# EAGLE schematic CPU (EAGLE 7.5.0), part 7 of 7
## Module ARDUINO
Ports: DATABUS_1(out) DATABUS_2(out) DATABUS_3(out) DATABUS_4(out) DATABUS_5(out) DATABUS_6(out) DATABUS_7(out) DATABUS_8(out) WRITE(out) SWITCH_BUSES(out) ADDRESSBUS_1(out) ADDRESSBUS_2(out) ADDRESSBUS_3(out) ADDRESSBUS_4(out) ADDRESSBUS_5(out) ADDRESSBUS_6(out) ADDRESSBUS_7(out) ADDRESSBUS_8(out) ADDRESSBUS_9(out) ADDRESSBUS_10(out) ADDRESSBUS_11(out) ADDRESSBUS_12(out) ADDRESSBUS_13(out) ADDRESSBUS_14(out) ADDRESSBUS_15(out) ADDRESSBUS_16(out) VCC(in) GND(in)
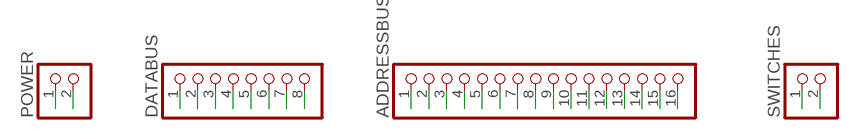
[diagram p96: schematic, module ARDUINO, sheet 1]

### Parts
ADDRESSBUS  PINHD-1X16  [1X16]
DATABUS  PINHD-1X8  [1X08]
POWER  PINHD-1X2  [1X02]
SWITCHES  PINHD-1X2  [1X02]

### Nets
ADDRESSBUS_1: ADDRESSBUS.1
ADDRESSBUS_2: ADDRESSBUS.2
ADDRESSBUS_3: ADDRESSBUS.3
ADDRESSBUS_4: ADDRESSBUS.4
ADDRESSBUS_5: ADDRESSBUS.5
ADDRESSBUS_6: ADDRESSBUS.6
ADDRESSBUS_7: ADDRESSBUS.7
ADDRESSBUS_8: ADDRESSBUS.8
ADDRESSBUS_9: ADDRESSBUS.9
ADDRESSBUS_10: ADDRESSBUS.10
ADDRESSBUS_11: ADDRESSBUS.11
ADDRESSBUS_12: ADDRESSBUS.12
ADDRESSBUS_13: ADDRESSBUS.13
ADDRESSBUS_14: ADDRESSBUS.14
ADDRESSBUS_15: ADDRESSBUS.15
ADDRESSBUS_16: ADDRESSBUS.16
DATABUS_1: DATABUS.1
DATABUS_2: DATABUS.2
DATABUS_3: DATABUS.3
DATABUS_4: DATABUS.4
DATABUS_5: DATABUS.5
DATABUS_6: DATABUS.6
DATABUS_7: DATABUS.7
DATABUS_8: DATABUS.8
GND: POWER.2
SWITCH_BUSES: SWITCHES.2
VCC: POWER.1
WRITE: SWITCHES.1

### Library data of the parts
ADDRESSBUS = pinhead:PINHD-1X16: PIN HEADER
DATABUS = pinhead:PINHD-1X8: PIN HEADER
POWER SWITCHES = pinhead:PINHD-1X2: PIN HEADER

## Module ARDUINO_INTERFACE
Ports: DATABUS_1(out) DATABUS_2(out) DATABUS_3(out) DATABUS_4(out) DATABUS_5(out) DATABUS_6(out) DATABUS_7(out) DATABUS_8(out) ADDRESSBUS_1(out) ADDRESSBUS_2(out) ADDRESSBUS_3(out) ADDRESSBUS_4(out) ADDRESSBUS_5(out) ADDRESSBUS_6(out) ADDRESSBUS_7(out) ADDRESSBUS_8(out) ADDRESSBUS_9(out) ADDRESSBUS_10(out) ADDRESSBUS_11(out) ADDRESSBUS_12(out) ADDRESSBUS_13(out) ADDRESSBUS_14(out) ADDRESSBUS_15(out) ADDRESSBUS_16(out) VCC(in) GND(in) LOAD_SRAM_INPUT(in) LOAD_SRAM_OUTPUT(out) SELECT_SRAM_INPUT(in) SELECT_SRAM_OUTPUT(out)
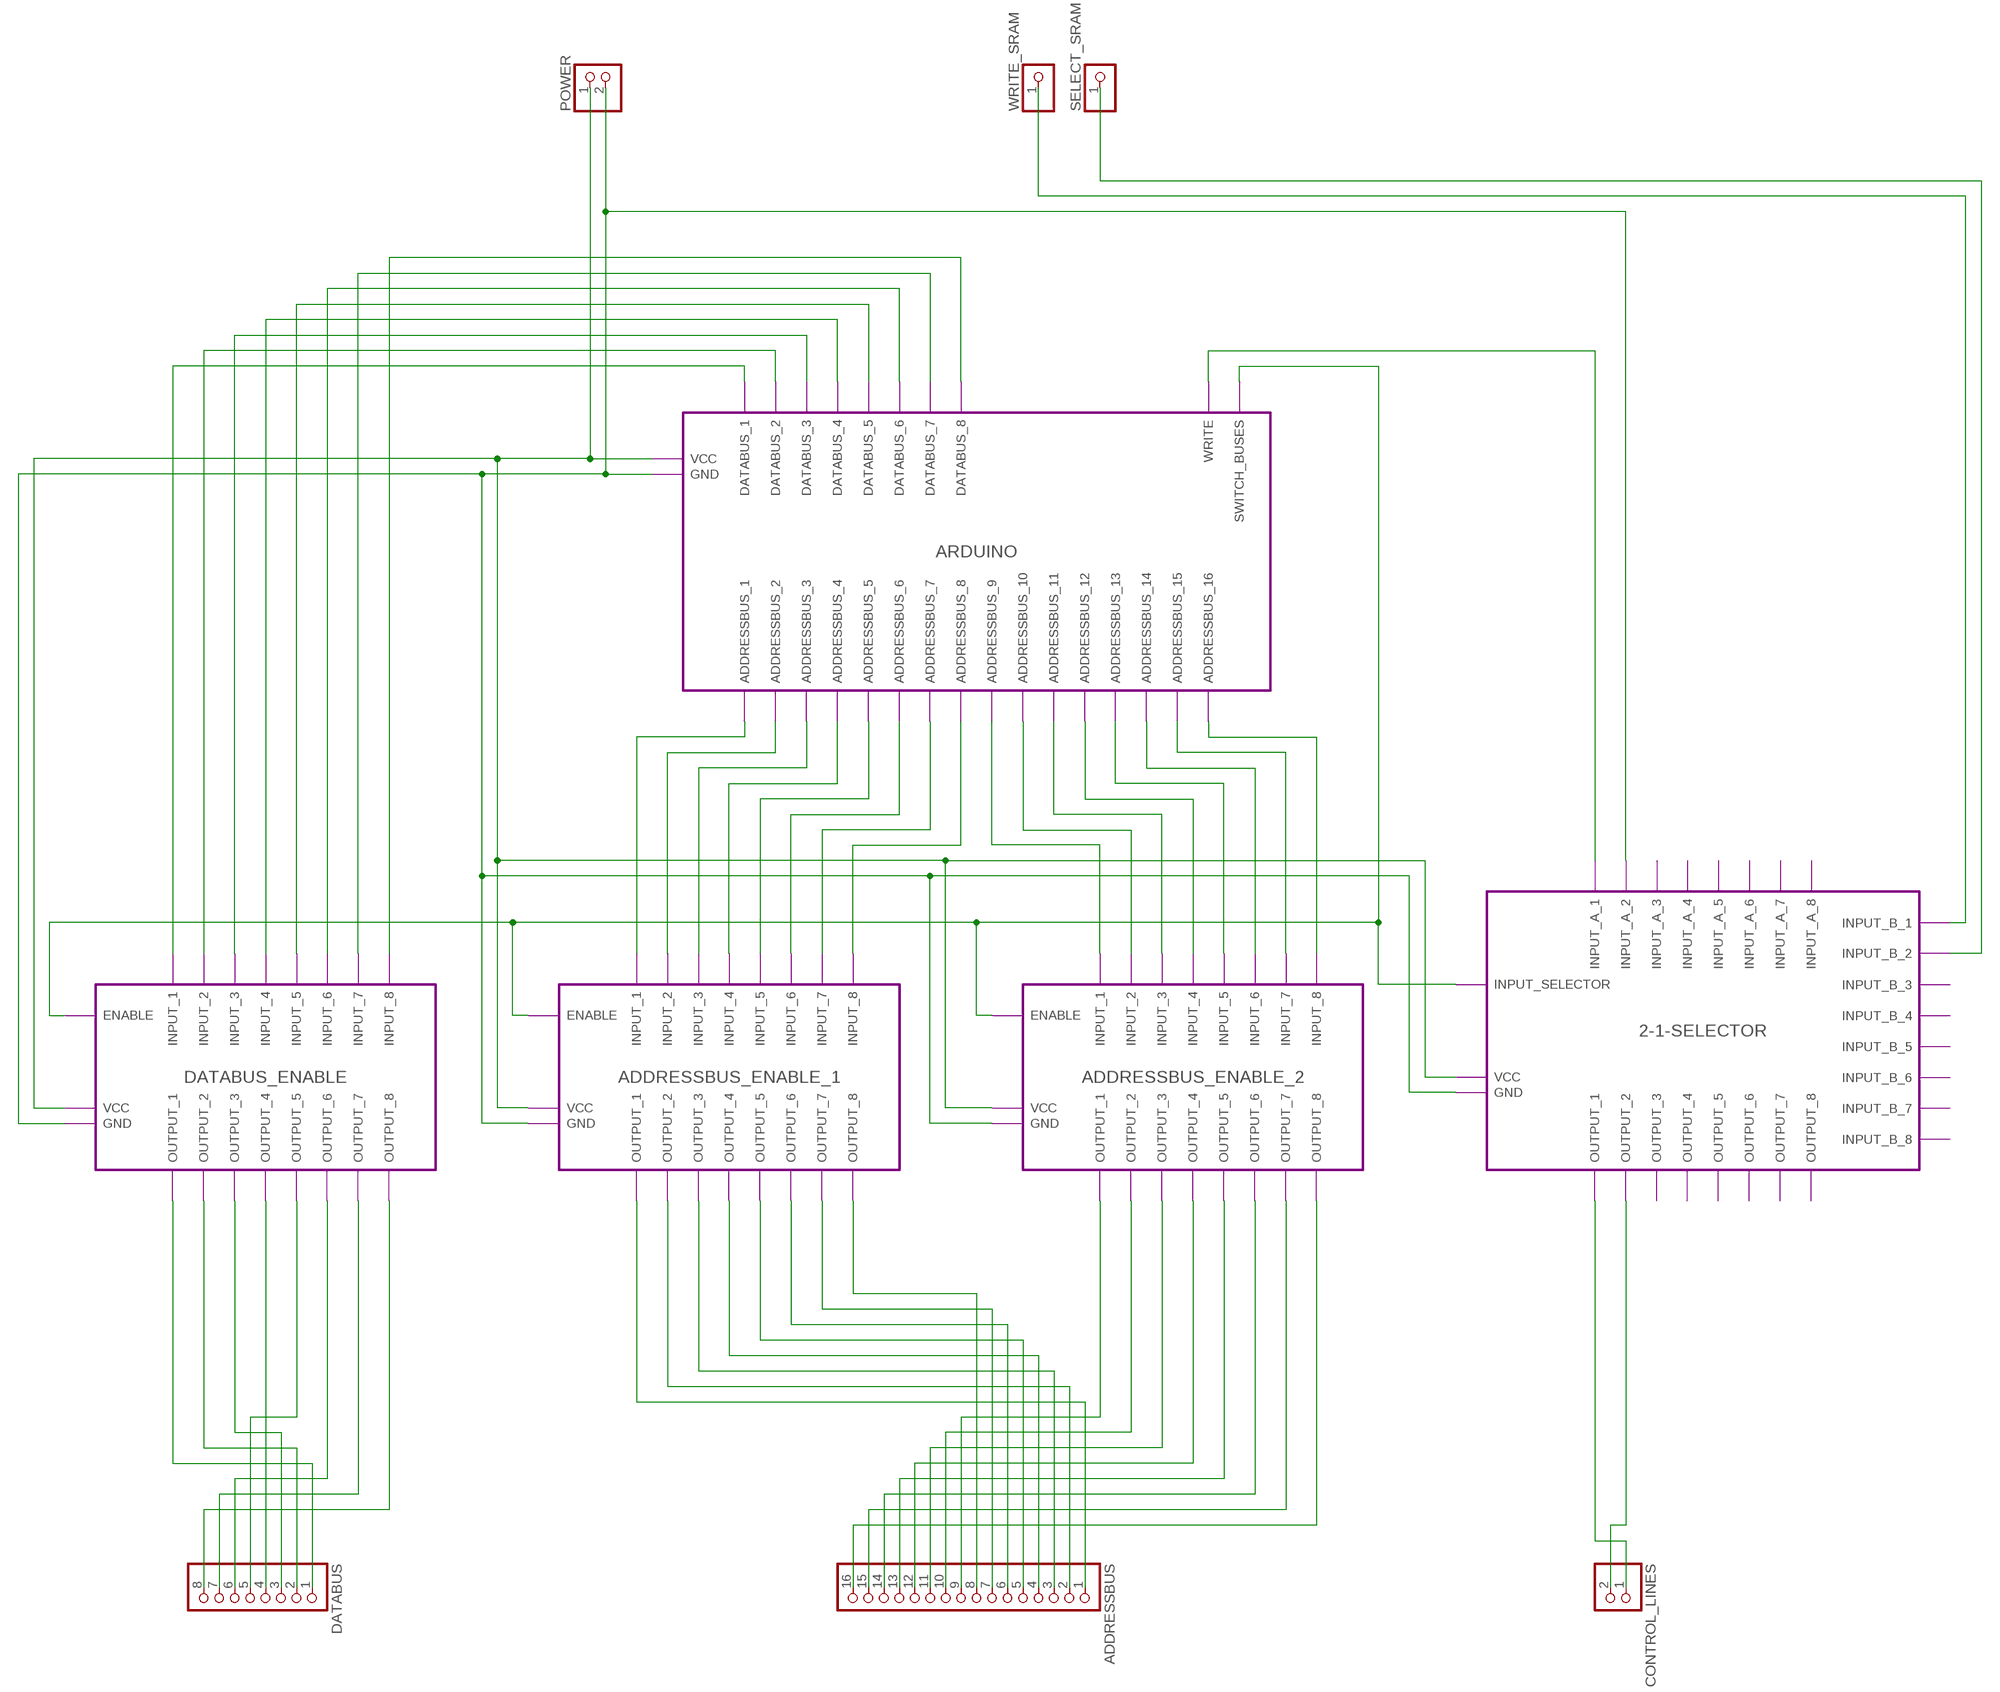
[diagram p97: schematic, module ARDUINO_INTERFACE, sheet 1]

### Parts
ADDRESSBUS  PINHD-1X16  [1X16]
CONTROL_LINES  PINHD-1X2  [1X02]
DATABUS  PINHD-1X8  [1X08]
POWER  PINHD-1X2  [1X02]
SELECT_SRAM  PINHD-1X1  [1X01]
WRITE_SRAM  PINHD-1X1  [1X01]

### Module instances
DATABUS_ENABLE = BUS_ENABLE
ADDRESSBUS_ENABLE_1 = BUS_ENABLE
ARDUINO = ARDUINO
2-1-SELECTOR = 2-1-SELECTOR
ADDRESSBUS_ENABLE_2 = BUS_ENABLE

### Nets
ADDRESSBUS_1: ADDRESSBUS.1 ; port ADDRESSBUS_ENABLE_1.OUTPUT_1
ADDRESSBUS_2: ADDRESSBUS.2 ; port ADDRESSBUS_ENABLE_1.OUTPUT_2
ADDRESSBUS_3: ADDRESSBUS.3 ; port ADDRESSBUS_ENABLE_1.OUTPUT_3
ADDRESSBUS_4: ADDRESSBUS.4 ; port ADDRESSBUS_ENABLE_1.OUTPUT_4
ADDRESSBUS_5: ADDRESSBUS.5 ; port ADDRESSBUS_ENABLE_1.OUTPUT_5
ADDRESSBUS_6: ADDRESSBUS.6 ; port ADDRESSBUS_ENABLE_1.OUTPUT_6
ADDRESSBUS_7: ADDRESSBUS.7 ; port ADDRESSBUS_ENABLE_1.OUTPUT_7
ADDRESSBUS_8: ADDRESSBUS.8 ; port ADDRESSBUS_ENABLE_1.OUTPUT_8
ADDRESSBUS_9: ADDRESSBUS.9 ; port ADDRESSBUS_ENABLE_2.OUTPUT_1
ADDRESSBUS_10: ADDRESSBUS.10 ; port ADDRESSBUS_ENABLE_2.OUTPUT_2
ADDRESSBUS_11: ADDRESSBUS.11 ; port ADDRESSBUS_ENABLE_2.OUTPUT_3
ADDRESSBUS_12: ADDRESSBUS.12 ; port ADDRESSBUS_ENABLE_2.OUTPUT_4
ADDRESSBUS_13: ADDRESSBUS.13 ; port ADDRESSBUS_ENABLE_2.OUTPUT_5
ADDRESSBUS_14: ADDRESSBUS.14 ; port ADDRESSBUS_ENABLE_2.OUTPUT_6
ADDRESSBUS_15: ADDRESSBUS.15 ; port ADDRESSBUS_ENABLE_2.OUTPUT_7
ADDRESSBUS_16: ADDRESSBUS.16 ; port ADDRESSBUS_ENABLE_2.OUTPUT_8
DATABUS_1: DATABUS.1 ; port DATABUS_ENABLE.OUTPUT_1
DATABUS_2: DATABUS.2 ; port DATABUS_ENABLE.OUTPUT_2
DATABUS_3: DATABUS.3 ; port DATABUS_ENABLE.OUTPUT_3
DATABUS_4: DATABUS.4 ; port DATABUS_ENABLE.OUTPUT_4
DATABUS_5: DATABUS.5 ; port DATABUS_ENABLE.OUTPUT_5
DATABUS_6: DATABUS.6 ; port DATABUS_ENABLE.OUTPUT_6
DATABUS_7: DATABUS.7 ; port DATABUS_ENABLE.OUTPUT_7
DATABUS_8: DATABUS.8 ; port DATABUS_ENABLE.OUTPUT_8
GND: POWER.2 ; port ARDUINO.GND 2-1-SELECTOR.INPUT_A_2 DATABUS_ENABLE.GND ADDRESSBUS_ENABLE_1.GND ADDRESSBUS_ENABLE_2.GND 2-1-SELECTOR.GND
LOAD_SRAM_INPUT: WRITE_SRAM.1
LOAD_SRAM_OUTPUT: CONTROL_LINES.1 ; port 2-1-SELECTOR.OUTPUT_1
N$1: port ARDUINO.ADDRESSBUS_1 ADDRESSBUS_ENABLE_1.INPUT_1
N$2: port ADDRESSBUS_ENABLE_1.INPUT_2 ARDUINO.ADDRESSBUS_2
N$3: port ARDUINO.ADDRESSBUS_3 ADDRESSBUS_ENABLE_1.INPUT_3
N$4: port ADDRESSBUS_ENABLE_1.INPUT_4 ARDUINO.ADDRESSBUS_4
N$5: port ARDUINO.ADDRESSBUS_5 ADDRESSBUS_ENABLE_1.INPUT_5
N$6: port ADDRESSBUS_ENABLE_1.INPUT_6 ARDUINO.ADDRESSBUS_6
N$7: port ARDUINO.ADDRESSBUS_7 ADDRESSBUS_ENABLE_1.INPUT_7
N$8: port ADDRESSBUS_ENABLE_1.INPUT_8 ARDUINO.ADDRESSBUS_8
N$9: port ARDUINO.ADDRESSBUS_16 ADDRESSBUS_ENABLE_2.INPUT_8
N$10: port ADDRESSBUS_ENABLE_2.INPUT_7 ARDUINO.ADDRESSBUS_15
N$11: port ARDUINO.ADDRESSBUS_14 ADDRESSBUS_ENABLE_2.INPUT_6
N$12: port ADDRESSBUS_ENABLE_2.INPUT_5 ARDUINO.ADDRESSBUS_13
N$13: port ARDUINO.ADDRESSBUS_12 ADDRESSBUS_ENABLE_2.INPUT_4
N$14: port ADDRESSBUS_ENABLE_2.INPUT_3 ARDUINO.ADDRESSBUS_11
N$15: port ARDUINO.ADDRESSBUS_10 ADDRESSBUS_ENABLE_2.INPUT_2
N$16: port ADDRESSBUS_ENABLE_2.INPUT_1 ARDUINO.ADDRESSBUS_9
N$17: port ARDUINO.DATABUS_1 DATABUS_ENABLE.INPUT_1
N$18: port ARDUINO.DATABUS_2 DATABUS_ENABLE.INPUT_2
N$19: port DATABUS_ENABLE.INPUT_3 ARDUINO.DATABUS_3
N$20: port ARDUINO.DATABUS_4 DATABUS_ENABLE.INPUT_4
N$21: port DATABUS_ENABLE.INPUT_5 ARDUINO.DATABUS_5
N$22: port ARDUINO.DATABUS_6 DATABUS_ENABLE.INPUT_6
N$23: port DATABUS_ENABLE.INPUT_7 ARDUINO.DATABUS_7
N$24: port ARDUINO.DATABUS_8 DATABUS_ENABLE.INPUT_8
N$25: port ARDUINO.SWITCH_BUSES DATABUS_ENABLE.ENABLE ADDRESSBUS_ENABLE_1.ENABLE ADDRESSBUS_ENABLE_2.ENABLE 2-1-SELECTOR.INPUT_SELECTOR
N$26: port ARDUINO.WRITE 2-1-SELECTOR.INPUT_A_1
SELECT_SRAM_INPUT: SELECT_SRAM.1 ; port 2-1-SELECTOR.INPUT_B_2
SELECT_SRAM_OUTPUT: CONTROL_LINES.2 ; port 2-1-SELECTOR.OUTPUT_2
VCC: POWER.1 ; port ARDUINO.VCC DATABUS_ENABLE.VCC ADDRESSBUS_ENABLE_1.VCC ADDRESSBUS_ENABLE_2.VCC 2-1-SELECTOR.VCC

### Library data of the parts
ADDRESSBUS = pinhead:PINHD-1X16: PIN HEADER
CONTROL_LINES POWER = pinhead:PINHD-1X2: PIN HEADER
DATABUS = pinhead:PINHD-1X8: PIN HEADER
SELECT_SRAM WRITE_SRAM = pinhead:PINHD-1X1: PIN HEADER

## Module FULL_ADDER_16BIT
Ports: INPUT_A_1(in) INPUT_A_2(in) INPUT_A_3(in) INPUT_A_4(in) INPUT_A_5(in) INPUT_A_6(in) INPUT_A_7(in) INPUT_A_8(in) INPUT_A_9(in) INPUT_A_10(in) INPUT_A_11(in) INPUT_A_12(in) INPUT_A_13(in) INPUT_A_14(in) INPUT_A_15(in) INPUT_A_16(in) INPUT_B_2(in) INPUT_B_1(in) INPUT_B_3(in) INPUT_B_4(in) INPUT_B_5(in) INPUT_B_6(in) INPUT_B_7(in) INPUT_B_8(in) INPUT_B_9(in) INPUT_B_10(in) INPUT_B_11(in) INPUT_B_12(in) INPUT_B_13(in) INPUT_B_14(in) INPUT_B_15(in) INPUT_B_16(in) RESULT_1(out) RESULT_2(out) RESULT_3(out) RESULT_4(out) RESULT_5(out) RESULT_6(out) RESULT_7(out) RESULT_8(out) RESULT_9(out) RESULT_10(out) RESULT_11(out) RESULT_12(out) RESULT_13(out) RESULT_14(out) RESULT_15(out) RESULT_16(out) VCC(in) GND(in) LOAD_ADDER16BIT_INPUT_A(in) LOAD_ADDER16BIT_INPUT_B(in) SELECT_ADDER16BIT_INPUT_A(in) SELECT_ADDER16BIT_INPUT_B(in) LOAD_ADDER16BIT_OUTPUT_C(in) SELECT_ADDER16BIT_OUTPUT_C(in)
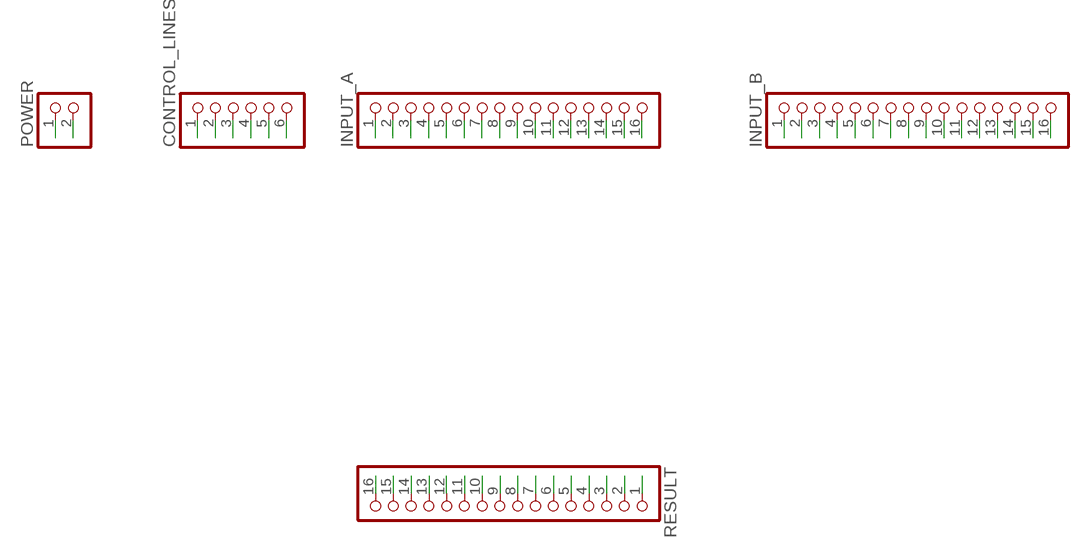
[diagram p98: schematic, module FULL_ADDER_16BIT, sheet 1]

### Parts
CONTROL_LINES  PINHD-1X6  [1X06]
INPUT_A  PINHD-1X16  [1X16]
INPUT_B  PINHD-1X16  [1X16]
POWER  PINHD-1X2  [1X02]
RESULT  PINHD-1X16  [1X16]

### Nets
GND: POWER.2
INPUT_A_1: INPUT_A.1
INPUT_A_2: INPUT_A.2
INPUT_A_3: INPUT_A.3
INPUT_A_4: INPUT_A.4
INPUT_A_5: INPUT_A.5
INPUT_A_6: INPUT_A.6
INPUT_A_7: INPUT_A.7
INPUT_A_8: INPUT_A.8
INPUT_A_9: INPUT_A.9
INPUT_A_10: INPUT_A.10
INPUT_A_11: INPUT_A.11
INPUT_A_12: INPUT_A.12
INPUT_A_13: INPUT_A.13
INPUT_A_14: INPUT_A.14
INPUT_A_15: INPUT_A.15
INPUT_A_16: INPUT_A.16
INPUT_B_1: INPUT_B.1
INPUT_B_2: INPUT_B.2
INPUT_B_3: INPUT_B.3
INPUT_B_4: INPUT_B.4
INPUT_B_5: INPUT_B.5
INPUT_B_6: INPUT_B.6
INPUT_B_7: INPUT_B.7
INPUT_B_8: INPUT_B.8
INPUT_B_9: INPUT_B.9
INPUT_B_10: INPUT_B.10
INPUT_B_11: INPUT_B.11
INPUT_B_12: INPUT_B.12
INPUT_B_13: INPUT_B.13
INPUT_B_14: INPUT_B.14
INPUT_B_15: INPUT_B.15
INPUT_B_16: INPUT_B.16
LOAD_ADDER16BIT_INPUT_A: CONTROL_LINES.1
LOAD_ADDER16BIT_INPUT_B: CONTROL_LINES.2
LOAD_ADDER16BIT_OUTPUT_C: CONTROL_LINES.5
RESULT_1: RESULT.1
RESULT_2: RESULT.2
RESULT_3: RESULT.3
RESULT_4: RESULT.4
RESULT_5: RESULT.5
RESULT_6: RESULT.6
RESULT_7: RESULT.7
RESULT_8: RESULT.8
RESULT_9: RESULT.9
RESULT_10: RESULT.10
RESULT_11: RESULT.11
RESULT_12: RESULT.12
RESULT_13: RESULT.13
RESULT_14: RESULT.14
RESULT_15: RESULT.15
RESULT_16: RESULT.16
SELECT_ADDER16BIT_INPUT_A: CONTROL_LINES.3
SELECT_ADDER16BIT_INPUT_B: CONTROL_LINES.4
SELECT_ADDER16BIT_OUTPUT_C: CONTROL_LINES.6
VCC: POWER.1

### Library data of the parts
CONTROL_LINES = pinhead:PINHD-1X6: PIN HEADER
INPUT_A INPUT_B RESULT = pinhead:PINHD-1X16: PIN HEADER
POWER = pinhead:PINHD-1X2: PIN HEADER

## Module BASE
Ports: ADDRESSBUS_1(io) ADDRESSBUS_2(io) ADDRESSBUS_3(io) ADDRESSBUS_4(io) ADDRESSBUS_5(io) ADDRESSBUS_6(io) ADDRESSBUS_7(io) ADDRESSBUS_8(io) ADDRESSBUS_9(io) ADDRESSBUS_10(io) ADDRESSBUS_11(io) ADDRESSBUS_12(io) ADDRESSBUS_13(io) ADDRESSBUS_14(io) ADDRESSBUS_15(io) ADDRESSBUS_16(io) CURRENT_INSTRUCTION_1(out) CURRENT_INSTRUCTION_2(out) CURRENT_INSTRUCTION_3(out) CURRENT_INSTRUCTION_4(out) CURRENT_INSTRUCTION_5(out) CURRENT_INSTRUCTION_6(out) CURRENT_INSTRUCTION_7(out) CURRENT_INSTRUCTION_8(out) DATABUS_1(io) DATABUS_2(io) DATABUS_3(io) DATABUS_4(io) DATABUS_5(io) DATABUS_6(io) DATABUS_7(io) DATABUS_8(io) ALU_FUNCTIONCODE_1(out) ALU_FUNCTIONCODE_2(out) ALU_FUNCTIONCODE_3(out) ALU_FUNCTIONCODE_4(out) FLAGSBUS_1(io) FLAGSBUS_2(io) FLAGSBUS_3(io) FLAGSBUS_4(io) INPUT_PORT_A_1(in) INPUT_PORT_A_2(in) INPUT_PORT_A_3(in) INPUT_PORT_A_4(in) INPUT_PORT_A_5(in) INPUT_PORT_A_6(in) INPUT_PORT_A_7(in) INPUT_PORT_A_8(in) INPUT_PORT_B_1(in) INPUT_PORT_B_3(in) INPUT_PORT_B_2(in) INPUT_PORT_B_4(in) INPUT_PORT_B_5(in) INPUT_PORT_B_6(in) INPUT_PORT_B_7(in) INPUT_PORT_B_8(in) OUTPUT_PORT_C_1(out) OUTPUT_PORT_C_2(out) OUTPUT_PORT_C_3(out) OUTPUT_PORT_C_4(out) OUTPUT_PORT_C_5(out) OUTPUT_PORT_C_6(out) OUTPUT_PORT_C_7(out) OUTPUT_PORT_C_8(out) OUTPUT_PORT_D_1(out) OUTPUT_PORT_D_2(out) OUTPUT_PORT_D_3(out) OUTPUT_PORT_D_4(out) OUTPUT_PORT_D_5(out) OUTPUT_PORT_D_6(out) OUTPUT_PORT_D_7(out) OUTPUT_PORT_D_8(out) T1(out) T2(out) T3(out) T4(out) T5(out) T6(out) T7(out) T8(out) GND(in) VCC(in) CLOCK(out) CPU_START(in) AUTO_MANUAL(in) MANUAL_TICK(in) LOAD_PORT_A(in) SELECT_PORT_A(in) LOAD_PORT_B(in) SELECT_PORT_B(in) LOAD_PORT_C(in) SELECT_PORT_C(in) LOAD_PORT_D(in) SELECT_PORT_D(in) SRAM_LOAD(in) SRAM_SELECT(in) LOAD_A(in) SELECT_A(in) LOAD_B(in) SELECT_B(in) LOAD_C(in) SELECT_C(in) LOAD_INTERNAL_A(in) SELECT_INTERNAL_A(in) LOAD_INC(in) SELECT_INC(in) LOAD_PC(in) SELECT_PC(in) LOAD_INSTRUCTION_REGISTER(in) SELECT_INSTRUCTION_REGISTER_TO_ALU(in) SELECT_INSTRUCTION_REGISTER_TO_DATABUS(in) LOAD_FLAGS(in) SELECT_FLAGS(in) LOAD_FLAGS_SAVED(in) SELECT_FLAGS_SAVED(in) PC_INCREMENTER_ENABLE(in) LOAD_FLAGS_INBUFFER(in) SELECT_FLAGS_INBUFFER(in) LOAD_FLAGS_OUTBUFFER(in) SELECT_FLAGS_OUTBUFFER(in) LOAD_ADDER16BIT_INPUT_A(in) SELECT_ADDER16BIT_INPUT_A(in) LOAD_ADDER16BIT_INPUT_B(in) SELECT_ADDER16BIT_INPUT_B(in) LOAD_ADDER16BIT_OUTPUT_C(in) SELECT_ADDER16BIT_OUTPUT_C(in) CPU_STOP(in)
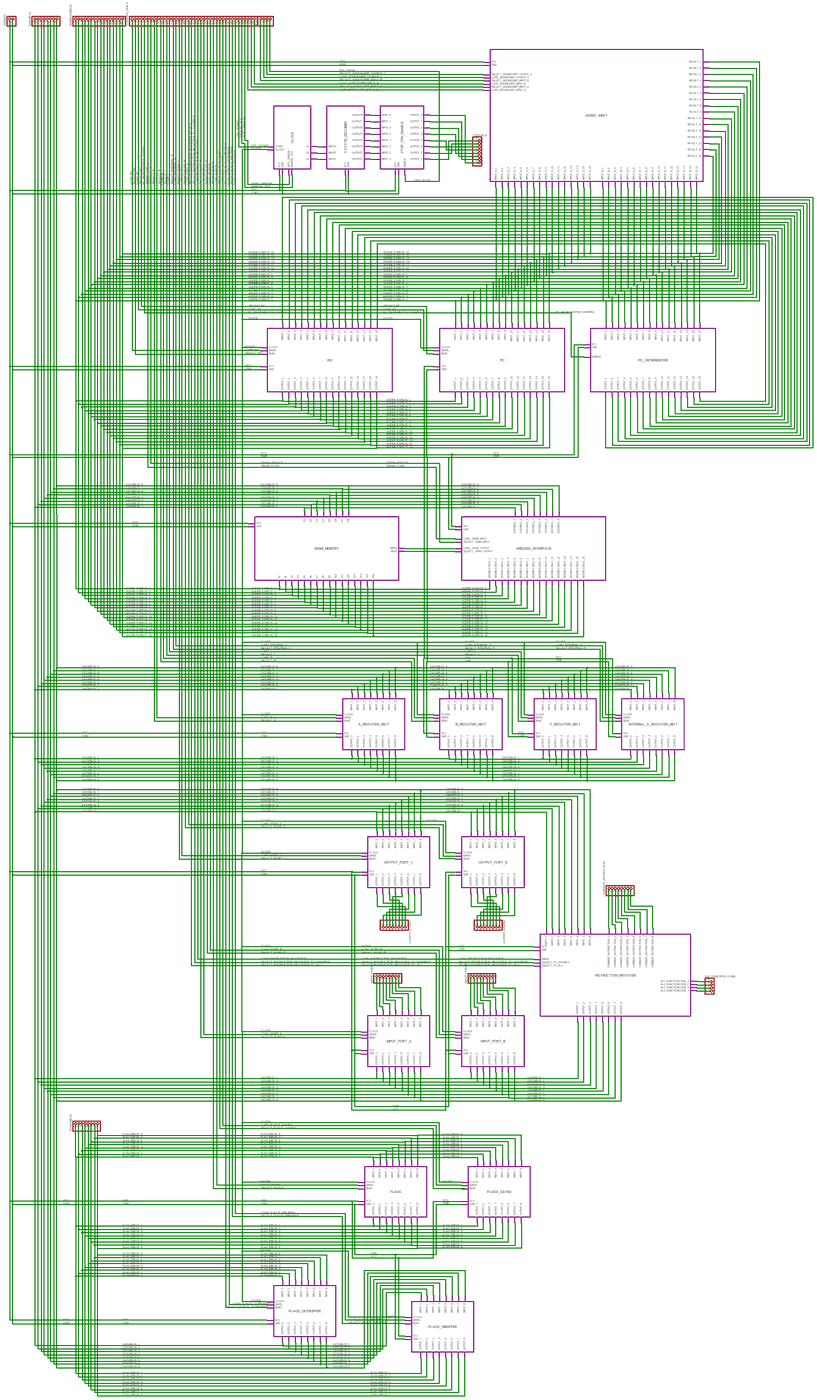
[diagram p99: schematic, module BASE, sheet 1, overview]
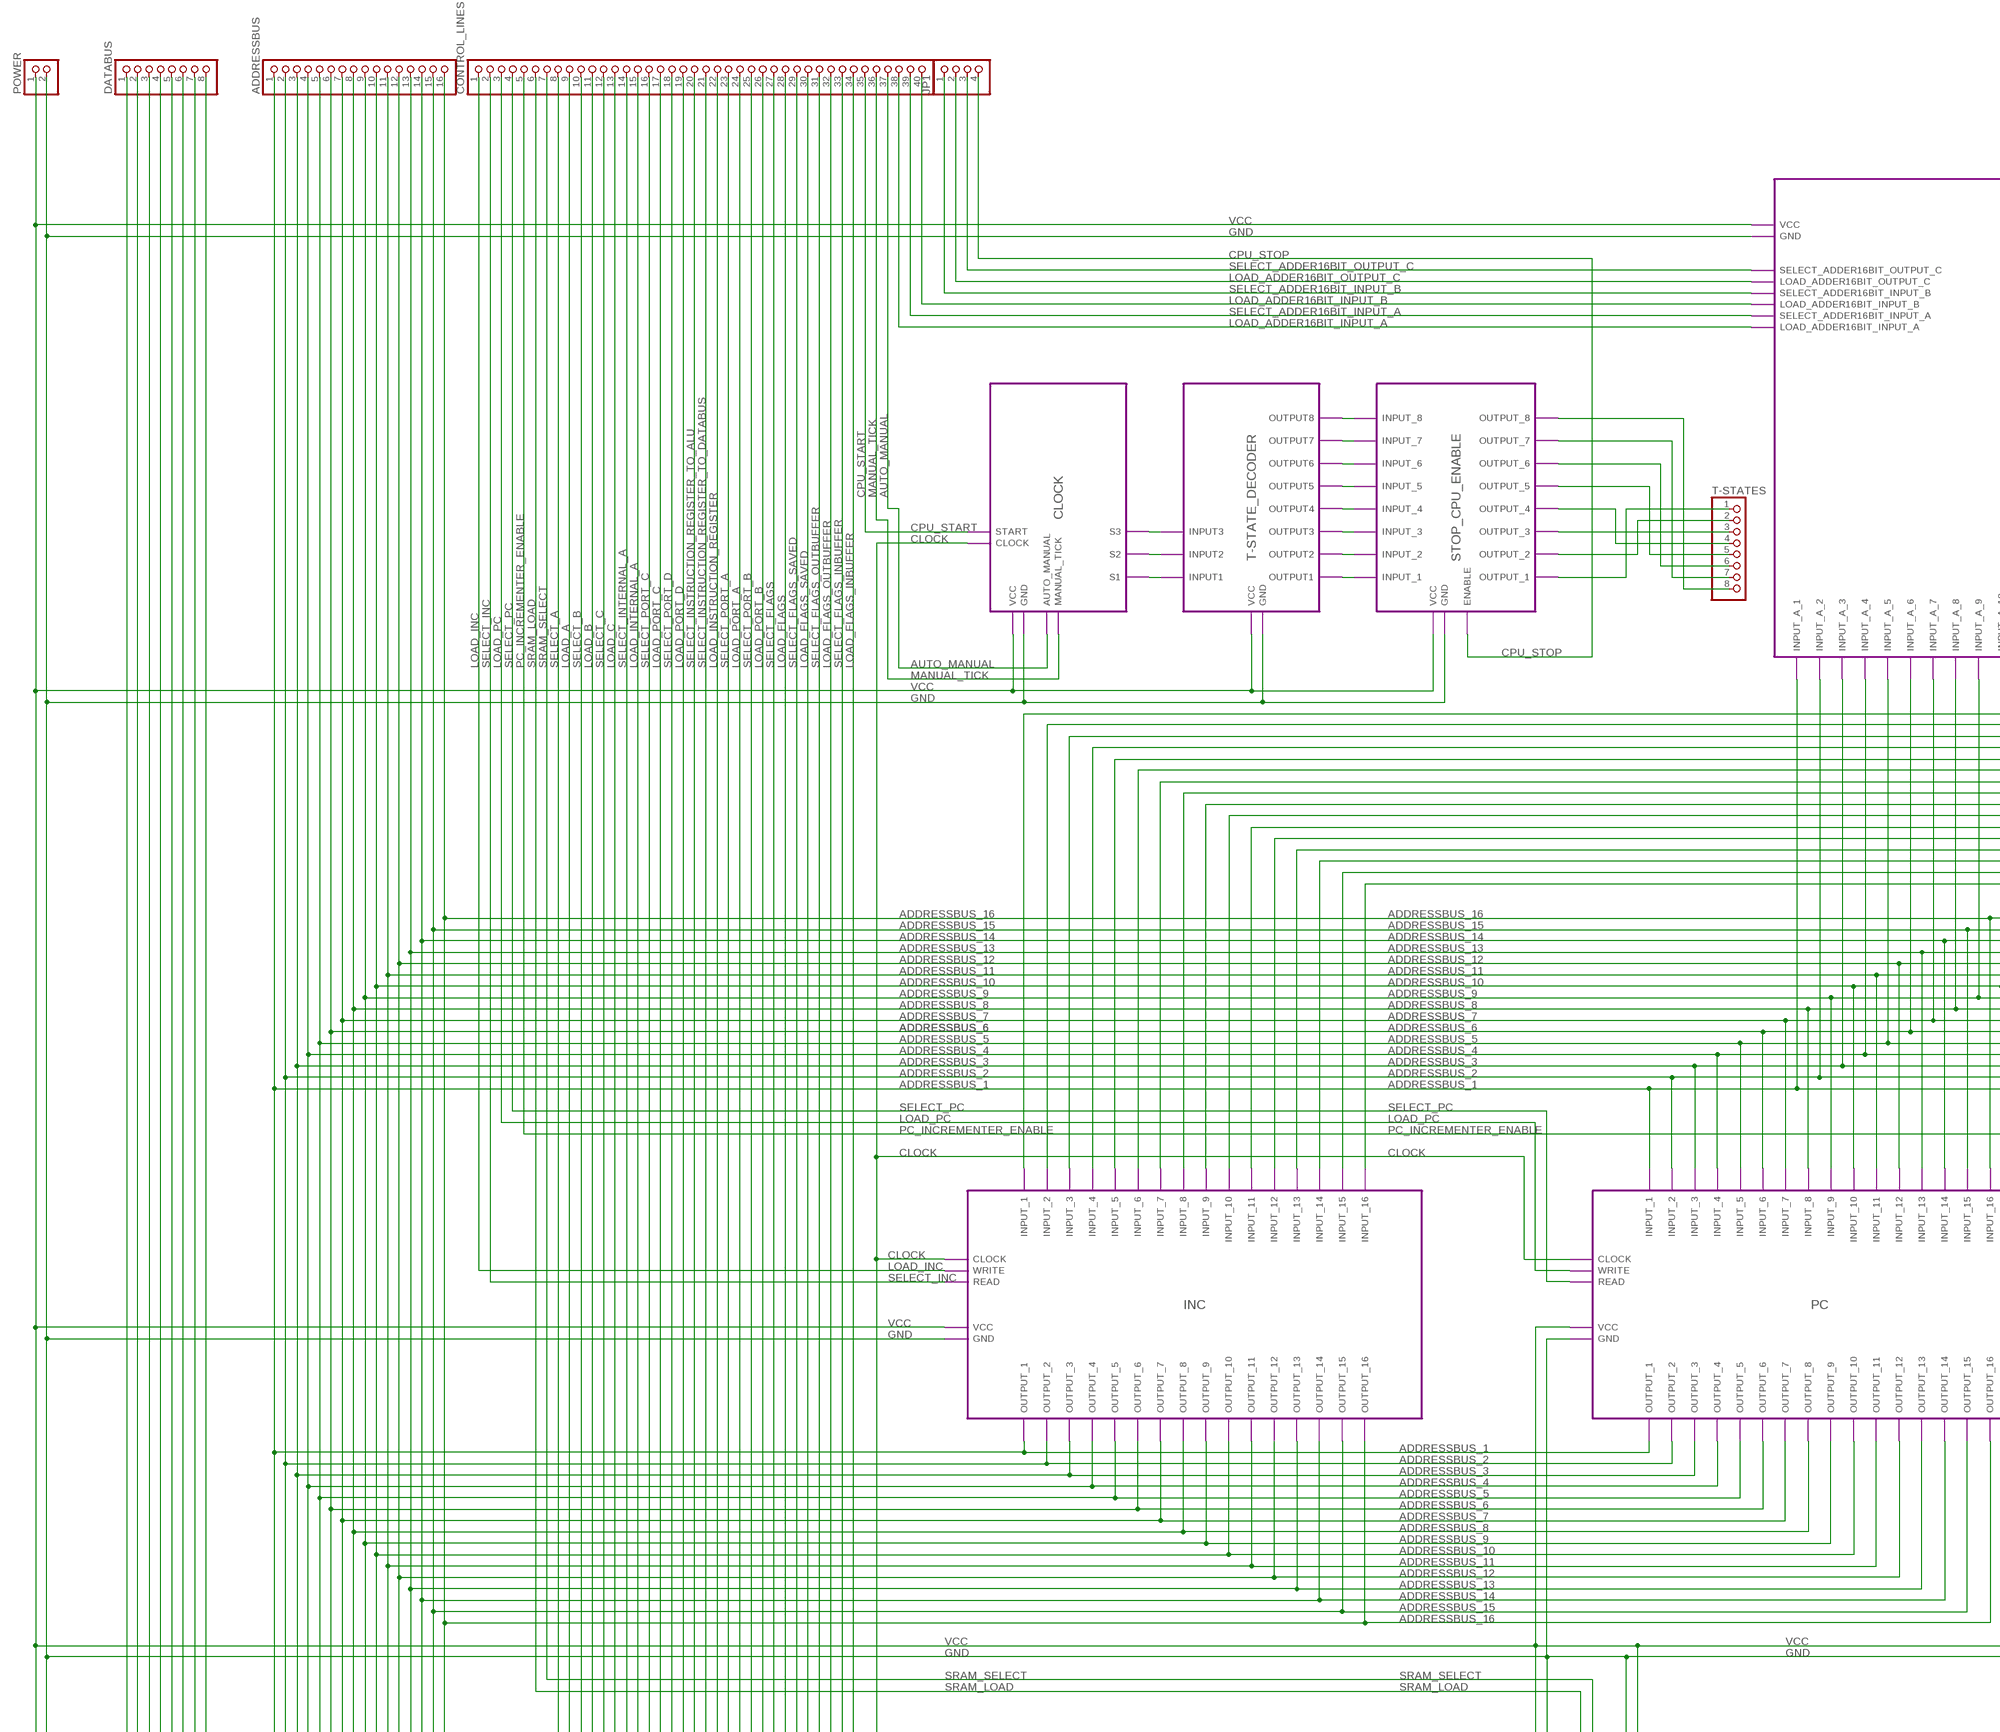
[diagram p100: schematic, module BASE, sheet 1, part 1 of 7]
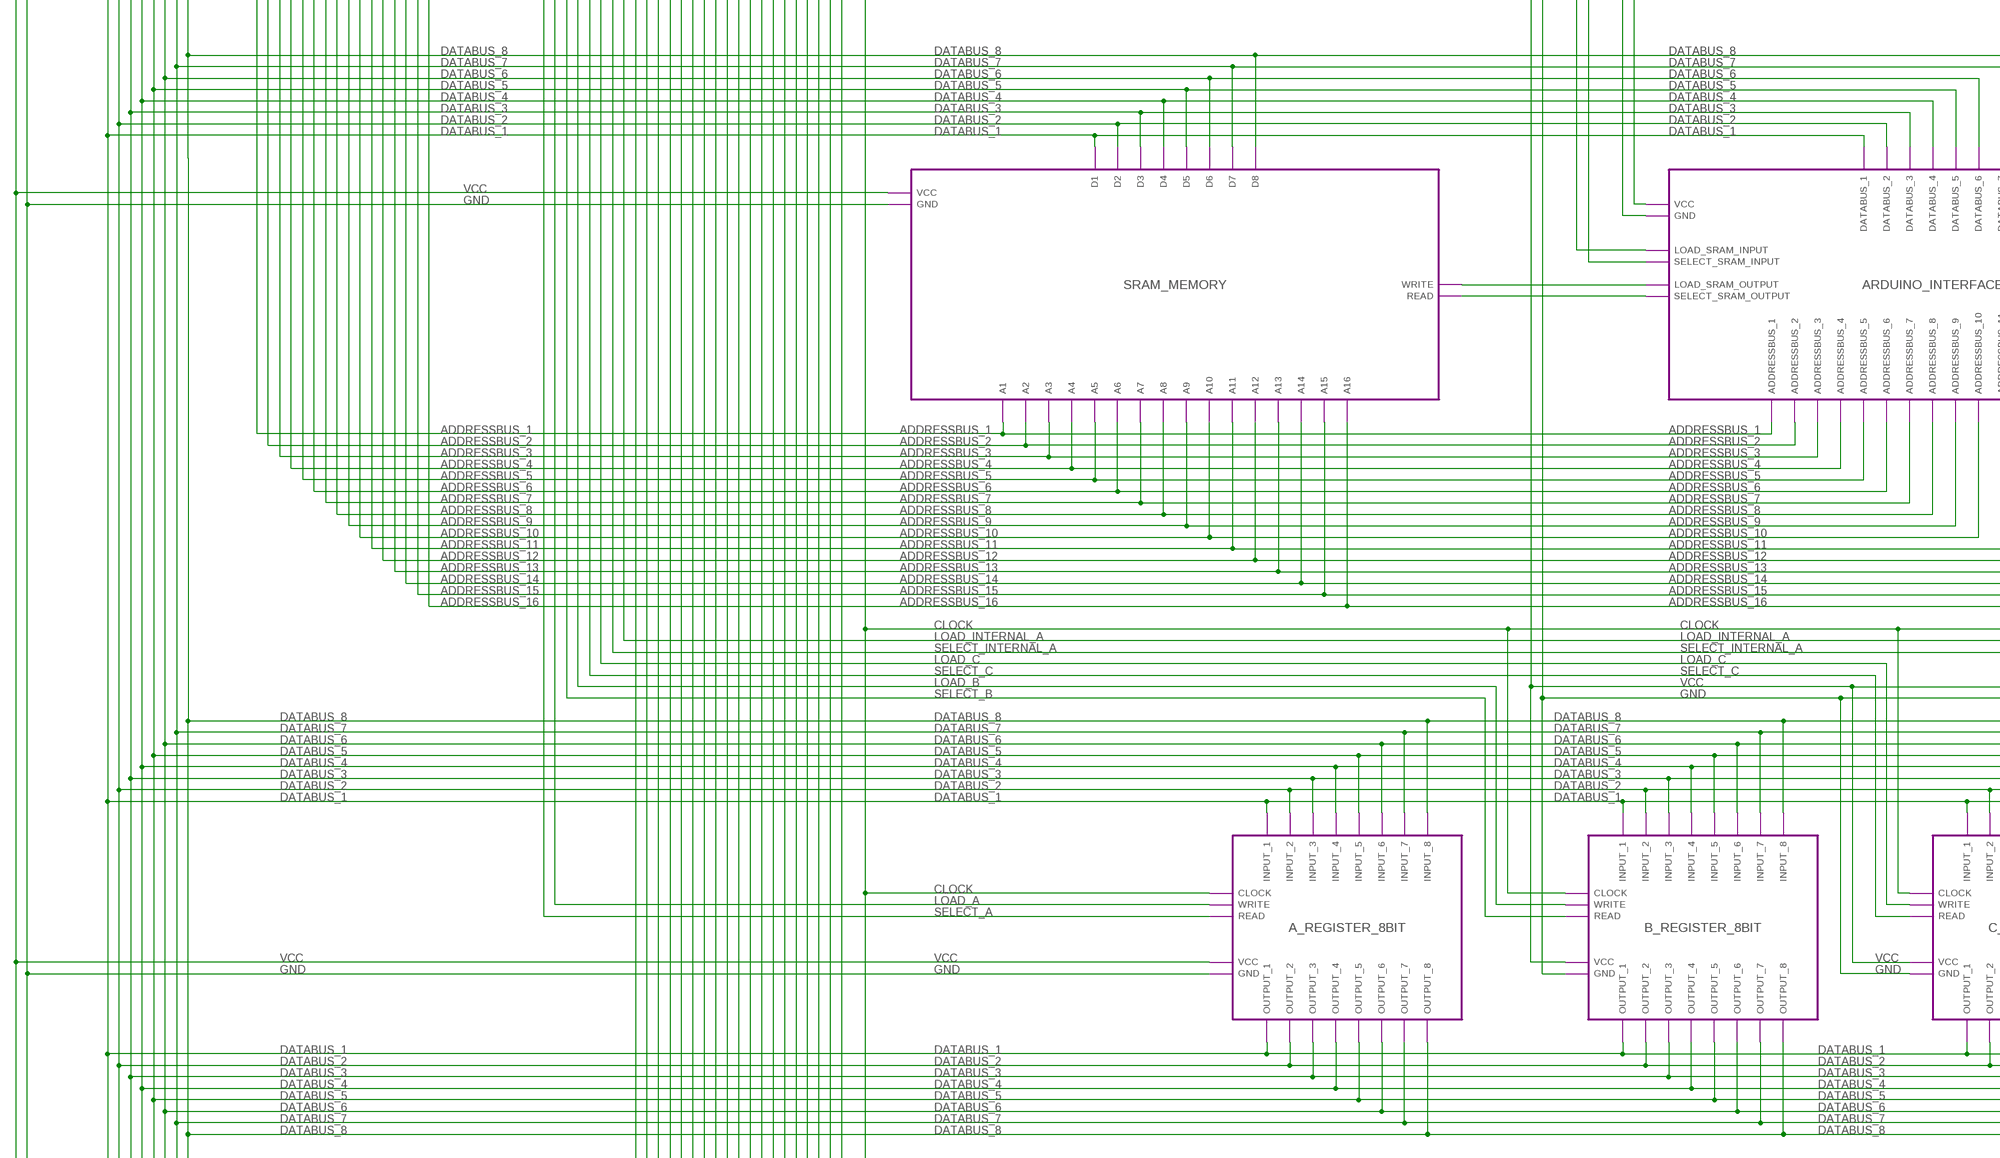
[diagram p101: schematic, module BASE, sheet 1, part 2 of 7]
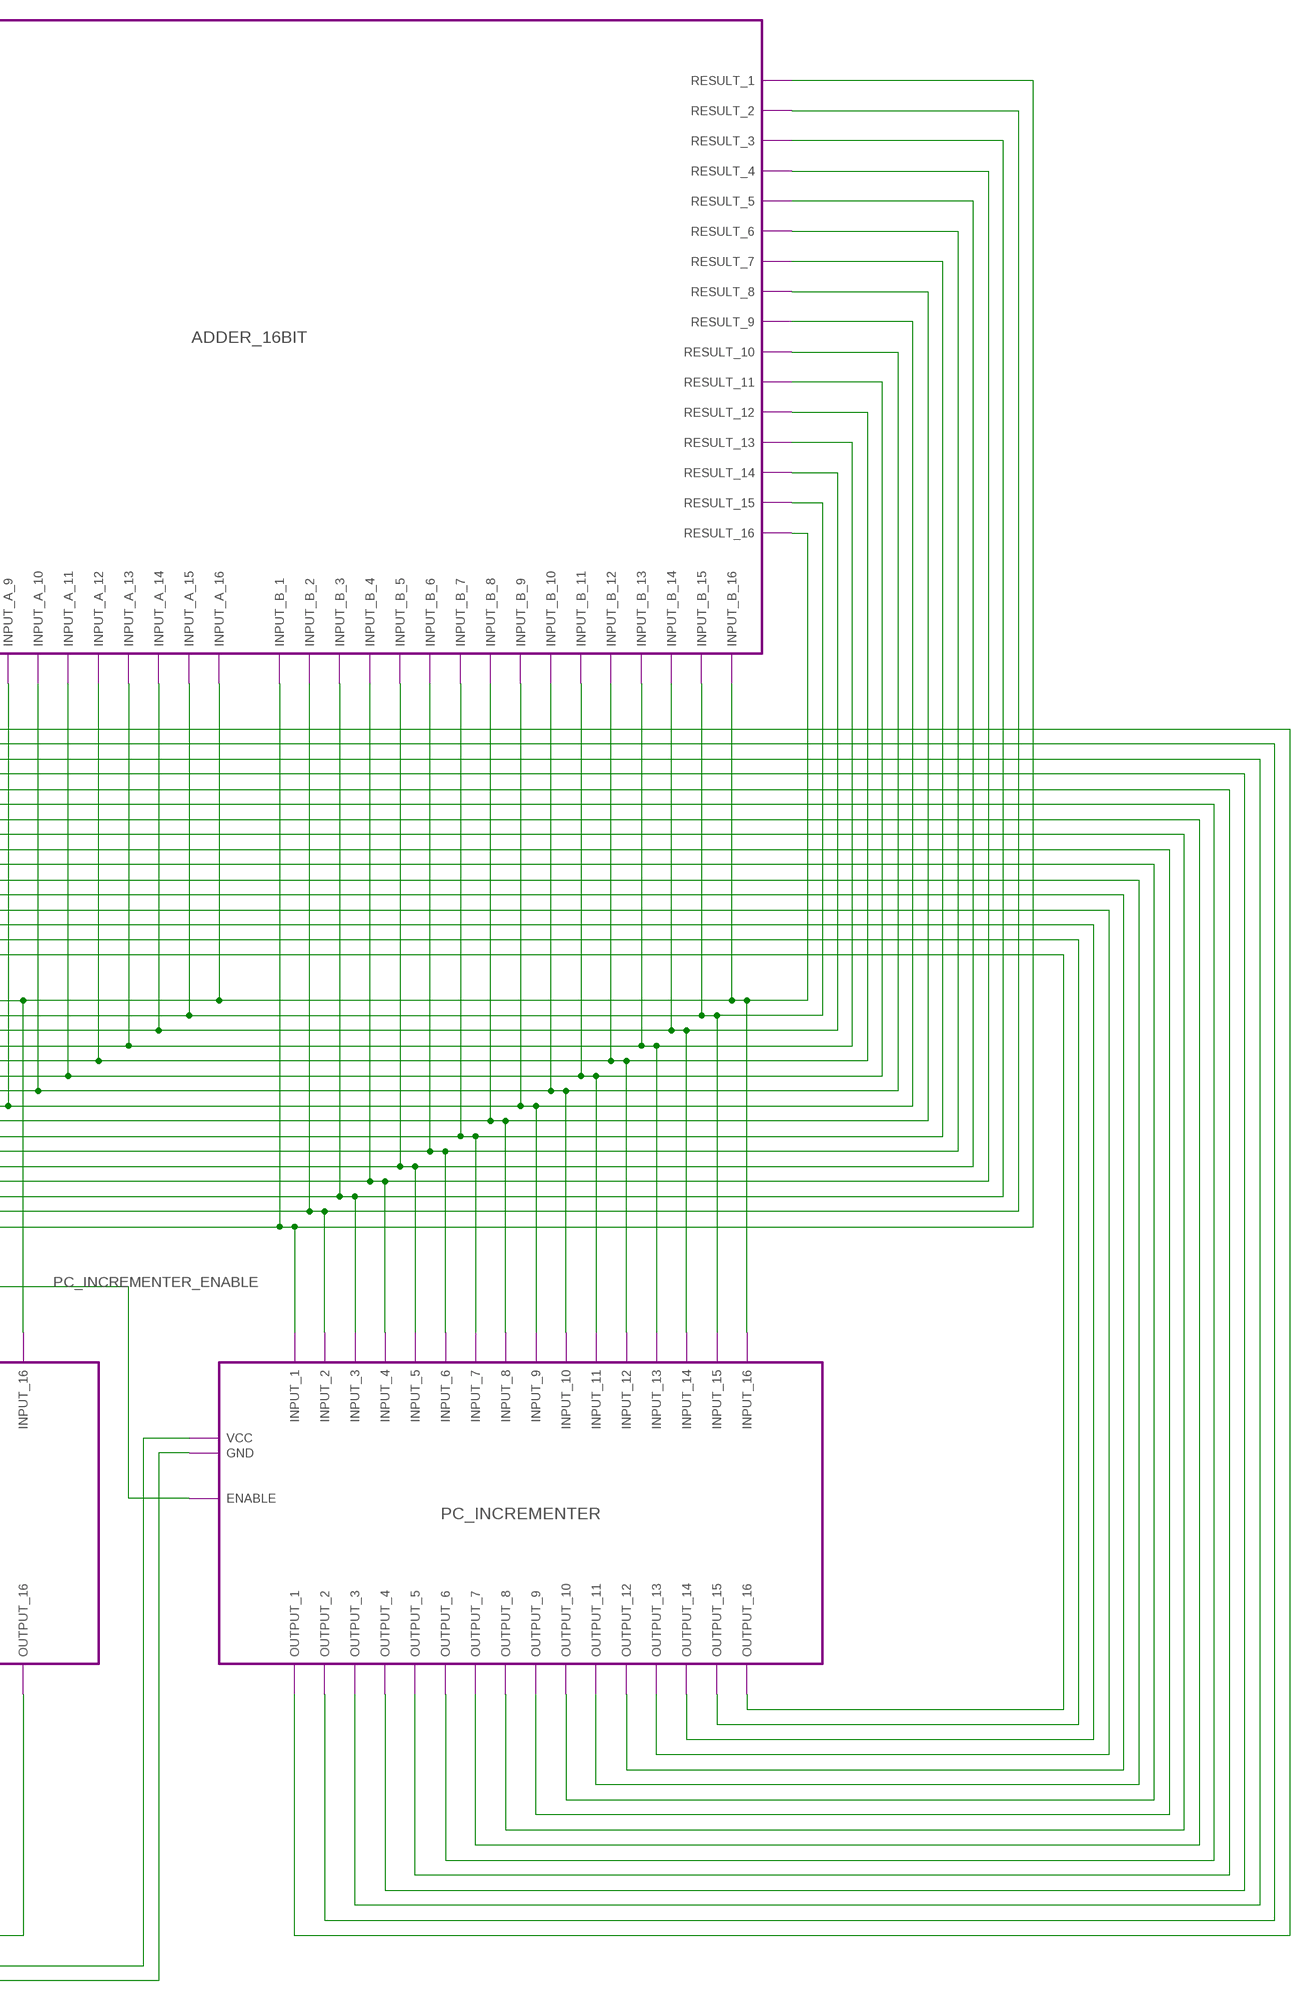
[diagram p102: schematic, module BASE, sheet 1, part 3 of 7]
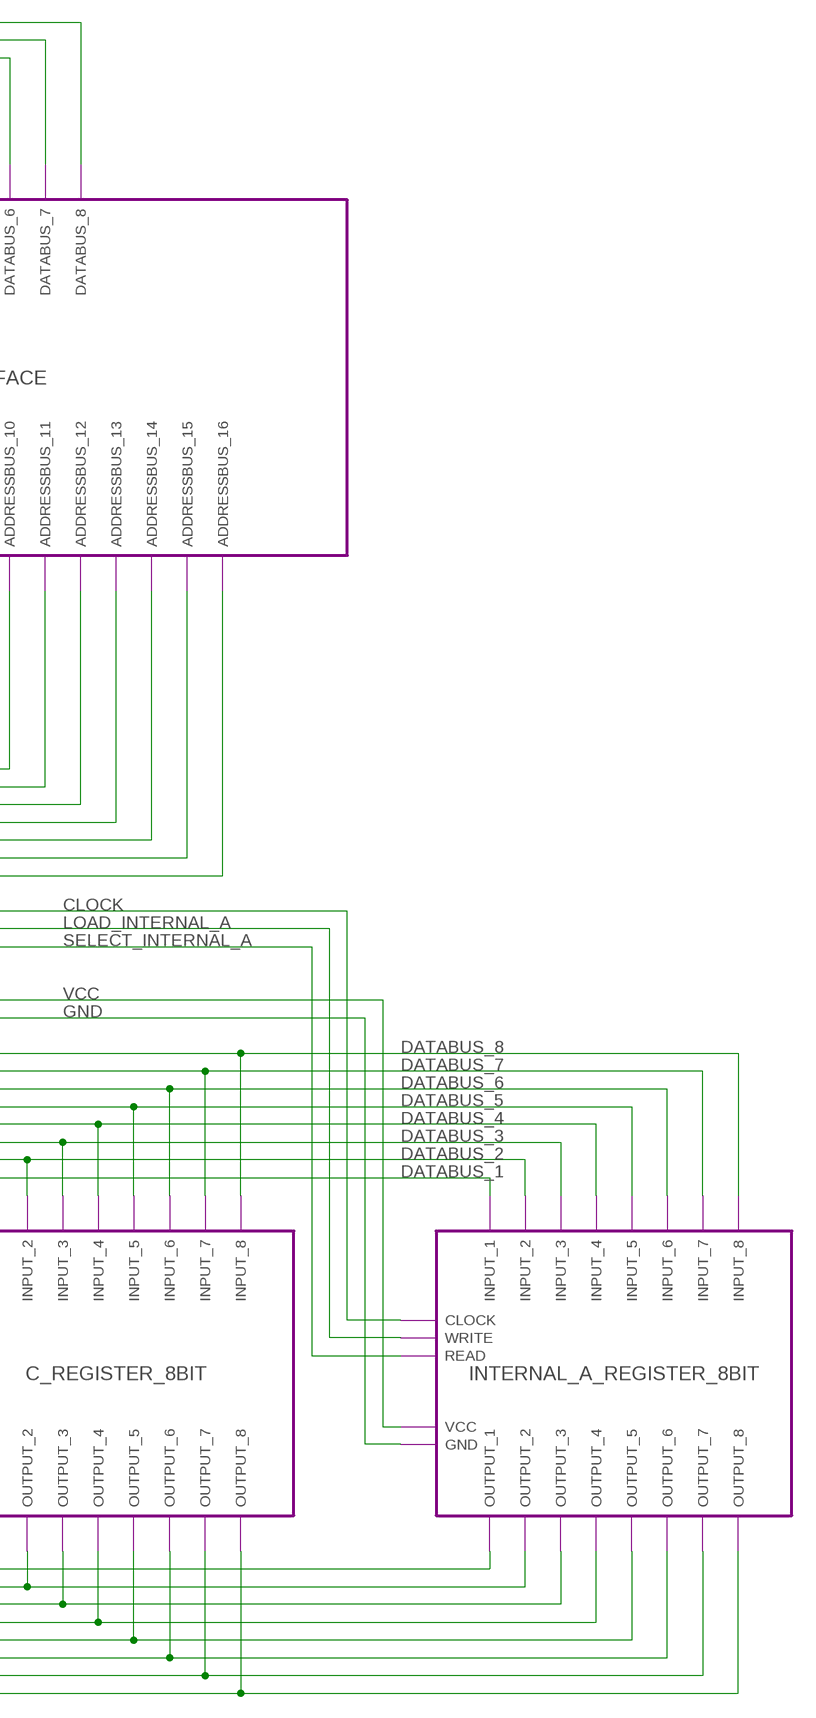
[diagram p103: schematic, module BASE, sheet 1, part 4 of 7]
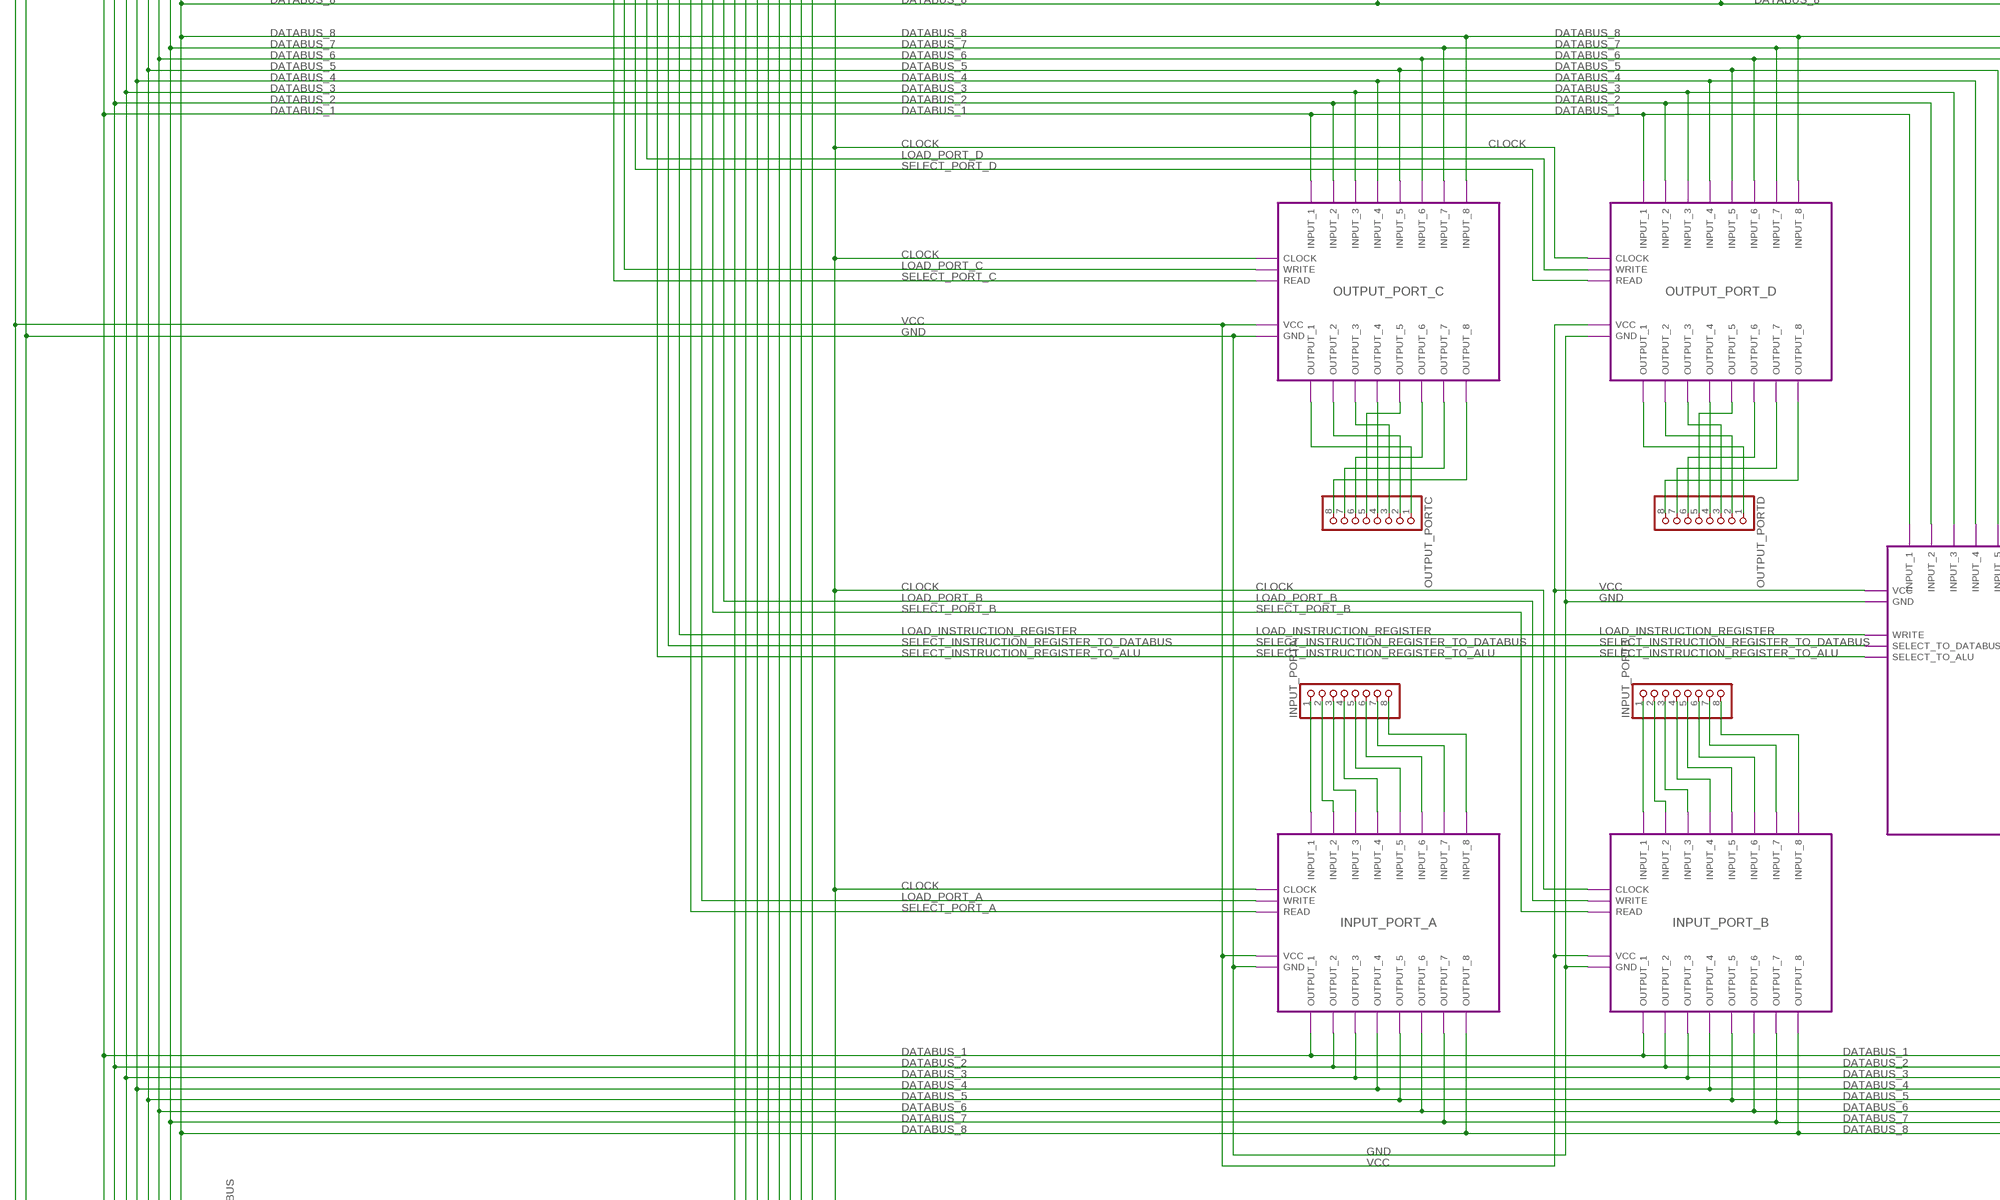
[diagram p104: schematic, module BASE, sheet 1, part 5 of 7]
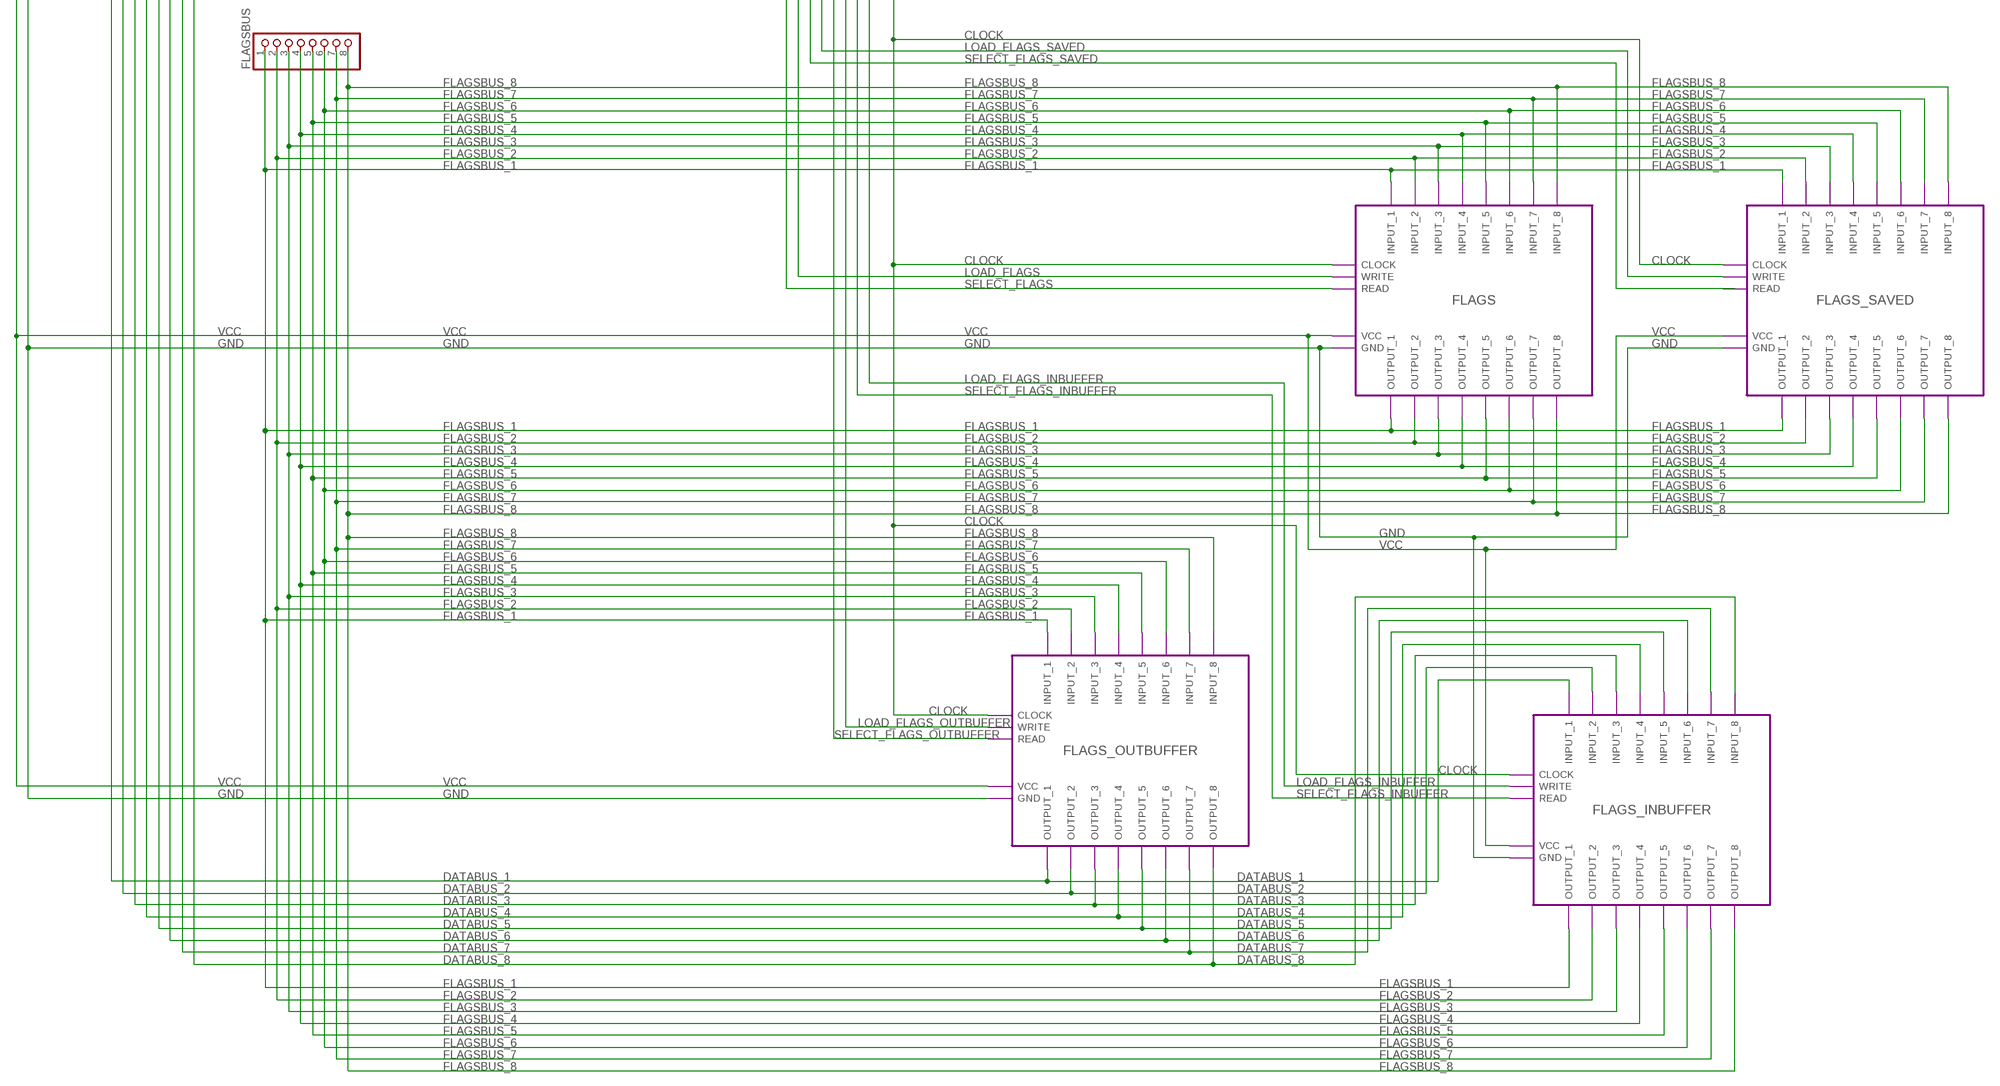
[diagram p105: schematic, module BASE, sheet 1, part 6 of 7]
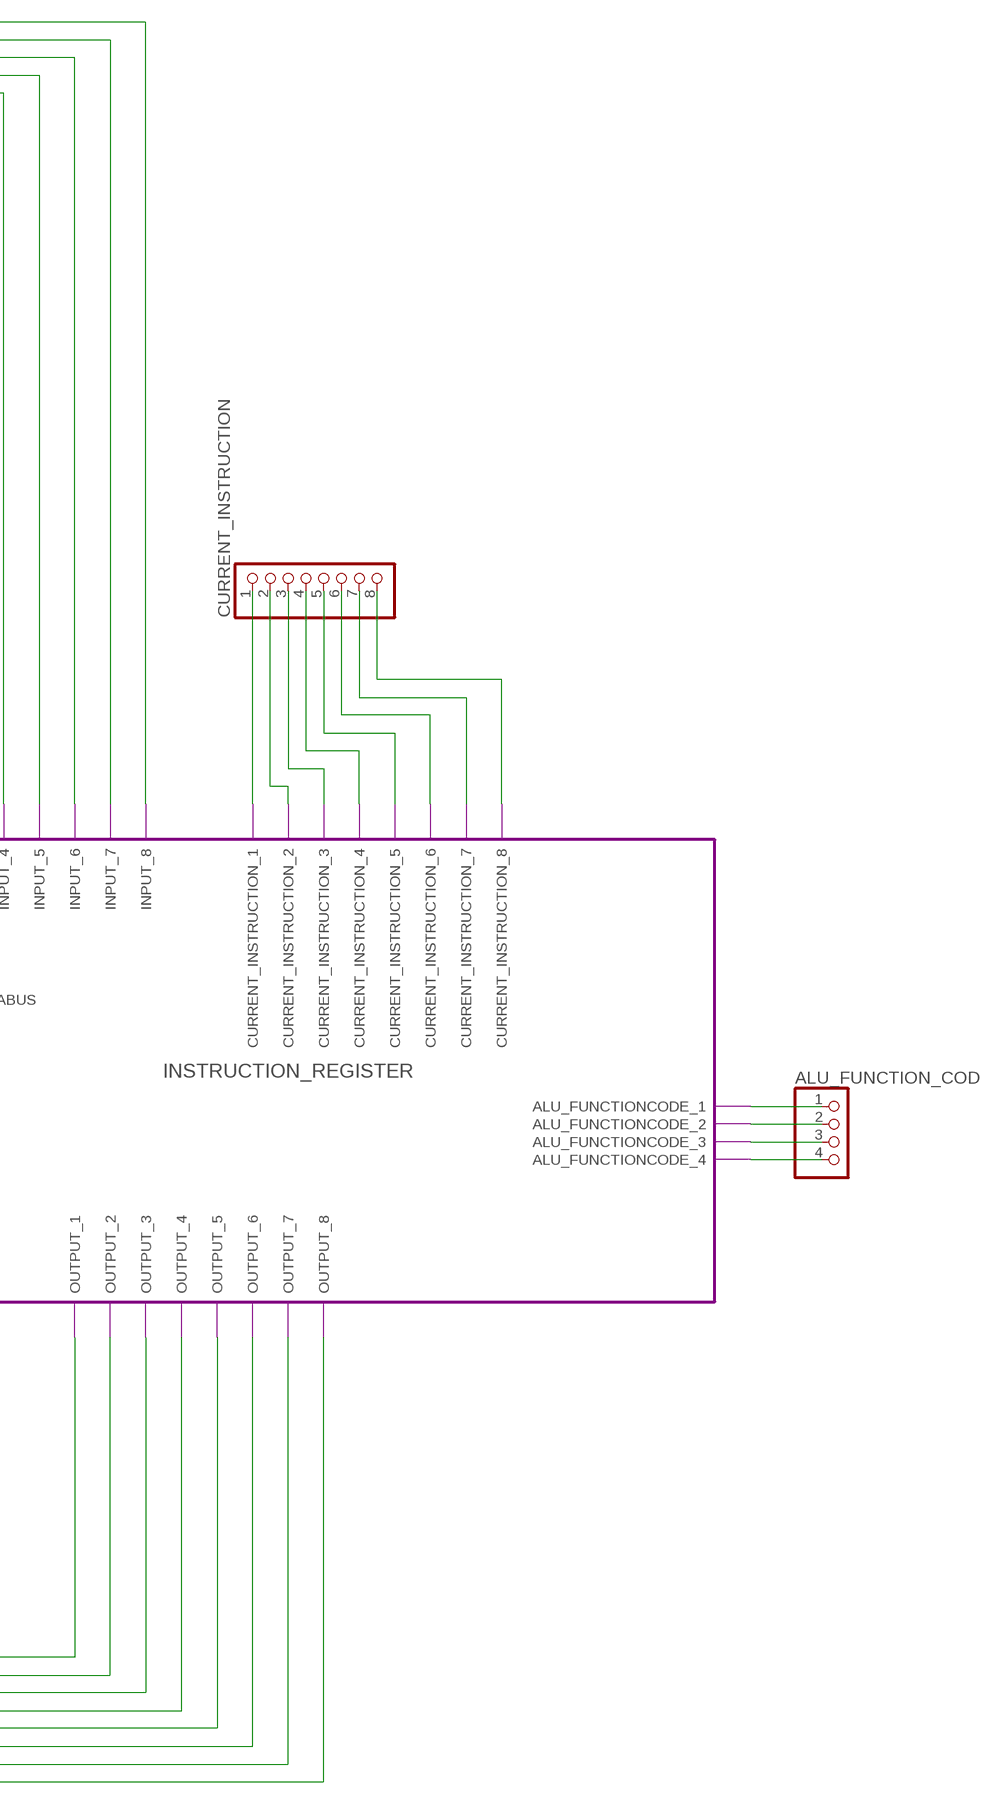
[diagram p106: schematic, module BASE, sheet 1, part 7 of 7]

### Parts
ADDRESSBUS  PINHD-1X16  [1X16]
ALU_FUNCTION_CODE  PINHD-1X4  [1X04]
CONTROL_LINES  PINHD-1X40  [1X40]
CURRENT_INSTRUCTION  PINHD-1X8  [1X08]
DATABUS  PINHD-1X8  [1X08]
FLAGSBUS  PINHD-1X8  [1X08]
INPUT_PORTA  PINHD-1X8  [1X08]
INPUT_PORTB  PINHD-1X8  [1X08]
JP1  PINHD-1X4  [1X04]
OUTPUT_PORTC  PINHD-1X8  [1X08]
OUTPUT_PORTD  PINHD-1X8  [1X08]
POWER  PINHD-1X2  [1X02]
T-STATES  PINHD-1X8  [1X08]

### Module instances
CLOCK = CLOCK
T-STATE_DECODER = 3-TO-8_DECODER
INC = REGISTER_16BIT
PC = REGISTER_16BIT
A_REGISTER_8BIT = REGISTER
B_REGISTER_8BIT = REGISTER
C_REGISTER_8BIT = REGISTER
SRAM_MEMORY = SRAM_MEMORY
INTERNAL_A_REGISTER_8BIT = INTERNAL_A
INSTRUCTION_REGISTER = INSTRUCTION_REGISTER
INPUT_PORT_B = REGISTER
INPUT_PORT_A = REGISTER
OUTPUT_PORT_C = REGISTER
OUTPUT_PORT_D = REGISTER
FLAGS = REGISTER
FLAGS_SAVED = REGISTER
FLAGS_INBUFFER = REGISTER
FLAGS_OUTBUFFER = REGISTER
PC_INCREMENTER = PC_INCREMENTER
ARDUINO_INTERFACE = ARDUINO_INTERFACE
ADDER_16BIT = FULL_ADDER_16BIT
STOP_CPU_ENABLE = ENABLE_CIRCUIT

### Nets
ADDRESSBUS_1: ADDRESSBUS.1 ; port PC.INPUT_1 INC.OUTPUT_1 PC.OUTPUT_1 SRAM_MEMORY.A1 PC_INCREMENTER.INPUT_1 ARDUINO_INTERFACE.ADDRESSBUS_1 ADDER_16BIT.INPUT_A_1 ADDER_16BIT.INPUT_B_1 ADDER_16BIT.RESULT_1
ADDRESSBUS_2: ADDRESSBUS.2 ; port PC.INPUT_2 INC.OUTPUT_2 PC.OUTPUT_2 PC_INCREMENTER.INPUT_2 SRAM_MEMORY.A2 ARDUINO_INTERFACE.ADDRESSBUS_2 ADDER_16BIT.INPUT_A_2 ADDER_16BIT.INPUT_B_2 ADDER_16BIT.RESULT_2
ADDRESSBUS_3: ADDRESSBUS.3 ; port PC.INPUT_3 INC.OUTPUT_3 PC.OUTPUT_3 PC_INCREMENTER.INPUT_3 SRAM_MEMORY.A3 ARDUINO_INTERFACE.ADDRESSBUS_3 ADDER_16BIT.INPUT_A_3 ADDER_16BIT.INPUT_B_3 ADDER_16BIT.RESULT_3
ADDRESSBUS_4: ADDRESSBUS.4 ; port PC.INPUT_4 INC.OUTPUT_4 PC.OUTPUT_4 PC_INCREMENTER.INPUT_4 SRAM_MEMORY.A4 ARDUINO_INTERFACE.ADDRESSBUS_4 ADDER_16BIT.INPUT_A_4 ADDER_16BIT.INPUT_B_4 ADDER_16BIT.RESULT_4
ADDRESSBUS_5: ADDRESSBUS.5 ; port PC.INPUT_5 INC.OUTPUT_5 PC.OUTPUT_5 PC_INCREMENTER.INPUT_5 SRAM_MEMORY.A5 ARDUINO_INTERFACE.ADDRESSBUS_5 ADDER_16BIT.INPUT_A_5 ADDER_16BIT.INPUT_B_5 ADDER_16BIT.RESULT_5
ADDRESSBUS_6: ADDRESSBUS.6 ; port PC.INPUT_6 INC.OUTPUT_6 PC.OUTPUT_6 PC_INCREMENTER.INPUT_6 SRAM_MEMORY.A6 ARDUINO_INTERFACE.ADDRESSBUS_6 ADDER_16BIT.INPUT_A_6 ADDER_16BIT.INPUT_B_6 ADDER_16BIT.RESULT_6
ADDRESSBUS_7: ADDRESSBUS.7 ; port PC.INPUT_7 INC.OUTPUT_7 PC.OUTPUT_7 PC_INCREMENTER.INPUT_7 SRAM_MEMORY.A7 ARDUINO_INTERFACE.ADDRESSBUS_7 ADDER_16BIT.INPUT_A_7 ADDER_16BIT.INPUT_B_7 ADDER_16BIT.RESULT_7
ADDRESSBUS_8: ADDRESSBUS.8 ; port PC.INPUT_8 INC.OUTPUT_8 PC.OUTPUT_8 PC_INCREMENTER.INPUT_8 SRAM_MEMORY.A8 ARDUINO_INTERFACE.ADDRESSBUS_8 ADDER_16BIT.INPUT_A_8 ADDER_16BIT.INPUT_B_8 ADDER_16BIT.RESULT_8
ADDRESSBUS_9: ADDRESSBUS.9 ; port PC.INPUT_9 INC.OUTPUT_9 PC.OUTPUT_9 PC_INCREMENTER.INPUT_9 SRAM_MEMORY.A9 ARDUINO_INTERFACE.ADDRESSBUS_9 ADDER_16BIT.INPUT_A_9 ADDER_16BIT.INPUT_B_9 ADDER_16BIT.RESULT_9
ADDRESSBUS_10: ADDRESSBUS.10 ; port PC.INPUT_10 INC.OUTPUT_10 PC.OUTPUT_10 PC_INCREMENTER.INPUT_10 SRAM_MEMORY.A10 ARDUINO_INTERFACE.ADDRESSBUS_10 ADDER_16BIT.INPUT_A_10 ADDER_16BIT.INPUT_B_10 ADDER_16BIT.RESULT_10
ADDRESSBUS_11: ADDRESSBUS.11 ; port PC.INPUT_11 INC.OUTPUT_11 PC.OUTPUT_11 PC_INCREMENTER.INPUT_11 SRAM_MEMORY.A11 ARDUINO_INTERFACE.ADDRESSBUS_11 ADDER_16BIT.INPUT_A_11 ADDER_16BIT.INPUT_B_11 ADDER_16BIT.RESULT_11
ADDRESSBUS_12: ADDRESSBUS.12 ; port PC.INPUT_12 INC.OUTPUT_12 PC.OUTPUT_12 PC_INCREMENTER.INPUT_12 SRAM_MEMORY.A12 ARDUINO_INTERFACE.ADDRESSBUS_12 ADDER_16BIT.INPUT_A_12 ADDER_16BIT.INPUT_B_12 ADDER_16BIT.RESULT_12
ADDRESSBUS_13: ADDRESSBUS.13 ; port PC.INPUT_13 INC.OUTPUT_13 PC.OUTPUT_13 PC_INCREMENTER.INPUT_13 SRAM_MEMORY.A13 ARDUINO_INTERFACE.ADDRESSBUS_13 ADDER_16BIT.INPUT_A_13 ADDER_16BIT.INPUT_B_13 ADDER_16BIT.RESULT_13
ADDRESSBUS_14: ADDRESSBUS.14 ; port PC.INPUT_14 INC.OUTPUT_14 PC.OUTPUT_14 PC_INCREMENTER.INPUT_14 SRAM_MEMORY.A14 ARDUINO_INTERFACE.ADDRESSBUS_14 ADDER_16BIT.INPUT_A_14 ADDER_16BIT.INPUT_B_14 ADDER_16BIT.RESULT_14
ADDRESSBUS_15: ADDRESSBUS.15 ; port PC.INPUT_15 INC.OUTPUT_15 PC.OUTPUT_15 PC_INCREMENTER.INPUT_15 SRAM_MEMORY.A15 ARDUINO_INTERFACE.ADDRESSBUS_15 ADDER_16BIT.INPUT_A_15 ADDER_16BIT.INPUT_B_15 ADDER_16BIT.RESULT_15
ADDRESSBUS_16: ADDRESSBUS.16 ; port PC.INPUT_16 INC.OUTPUT_16 PC.OUTPUT_16 PC_INCREMENTER.INPUT_16 SRAM_MEMORY.A16 ARDUINO_INTERFACE.ADDRESSBUS_16 ADDER_16BIT.INPUT_A_16 ADDER_16BIT.INPUT_B_16 ADDER_16BIT.RESULT_16
ALU_FUNCTIONCODE_1: ALU_FUNCTION_CODE.1 ; port INSTRUCTION_REGISTER.ALU_FUNCTIONCODE_1
ALU_FUNCTIONCODE_2: ALU_FUNCTION_CODE.2 ; port INSTRUCTION_REGISTER.ALU_FUNCTIONCODE_2
ALU_FUNCTIONCODE_3: ALU_FUNCTION_CODE.3 ; port INSTRUCTION_REGISTER.ALU_FUNCTIONCODE_3
ALU_FUNCTIONCODE_4: ALU_FUNCTION_CODE.4 ; port INSTRUCTION_REGISTER.ALU_FUNCTIONCODE_4
AUTO_MANUAL: CONTROL_LINES.37 ; port CLOCK.AUTO_MANUAL
CLOCK: port FLAGS_INBUFFER.CLOCK B_REGISTER_8BIT.CLOCK INC.CLOCK A_REGISTER_8BIT.CLOCK C_REGISTER_8BIT.CLOCK INTERNAL_A_REGISTER_8BIT.CLOCK OUTPUT_PORT_C.CLOCK OUTPUT_PORT_D.CLOCK INPUT_PORT_A.CLOCK INPUT_PORT_B.CLOCK FLAGS_OUTBUFFER.CLOCK FLAGS.CLOCK PC.CLOCK CLOCK.CLOCK FLAGS_SAVED.CLOCK
CPU_START: CONTROL_LINES.35 ; port CLOCK.START
CPU_STOP: JP1.4 ; port STOP_CPU_ENABLE.ENABLE
CURRENT_INSTRUCTION_1: CURRENT_INSTRUCTION.1 ; port INSTRUCTION_REGISTER.CURRENT_INSTRUCTION_1
CURRENT_INSTRUCTION_2: CURRENT_INSTRUCTION.2 ; port INSTRUCTION_REGISTER.CURRENT_INSTRUCTION_2
CURRENT_INSTRUCTION_3: CURRENT_INSTRUCTION.3 ; port INSTRUCTION_REGISTER.CURRENT_INSTRUCTION_3
CURRENT_INSTRUCTION_4: CURRENT_INSTRUCTION.4 ; port INSTRUCTION_REGISTER.CURRENT_INSTRUCTION_4
CURRENT_INSTRUCTION_5: CURRENT_INSTRUCTION.5 ; port INSTRUCTION_REGISTER.CURRENT_INSTRUCTION_5
CURRENT_INSTRUCTION_6: CURRENT_INSTRUCTION.6 ; port INSTRUCTION_REGISTER.CURRENT_INSTRUCTION_6
CURRENT_INSTRUCTION_7: CURRENT_INSTRUCTION.7 ; port INSTRUCTION_REGISTER.CURRENT_INSTRUCTION_7
CURRENT_INSTRUCTION_8: CURRENT_INSTRUCTION.8 ; port INSTRUCTION_REGISTER.CURRENT_INSTRUCTION_8
DATABUS_1: DATABUS.1 ; port SRAM_MEMORY.D1 B_REGISTER_8BIT.OUTPUT_1 FLAGS_OUTBUFFER.OUTPUT_1 FLAGS_INBUFFER.INPUT_1 INTERNAL_A_REGISTER_8BIT.INPUT_1 INPUT_PORT_B.OUTPUT_1 INPUT_PORT_A.OUTPUT_1 A_REGISTER_8BIT.INPUT_1 A_REGISTER_8BIT.OUTPUT_1 B_REGISTER_8BIT.INPUT_1 C_REGISTER_8BIT.OUTPUT_1 INTERNAL_A_REGISTER_8BIT.OUTPUT_1 C_REGISTER_8BIT.INPUT_1 INSTRUCTION_REGISTER.OUTPUT_1 OUTPUT_PORT_D.INPUT_1 OUTPUT_PORT_C.INPUT_1 INSTRUCTION_REGISTER.INPUT_1 ARDUINO_INTERFACE.DATABUS_1
DATABUS_2: DATABUS.2 ; port SRAM_MEMORY.D2 INTERNAL_A_REGISTER_8BIT.INPUT_2 INTERNAL_A_REGISTER_8BIT.OUTPUT_2 FLAGS_OUTBUFFER.OUTPUT_2 OUTPUT_PORT_D.INPUT_2 OUTPUT_PORT_C.INPUT_2 FLAGS_INBUFFER.INPUT_2 INSTRUCTION_REGISTER.INPUT_2 INPUT_PORT_B.OUTPUT_2 INPUT_PORT_A.OUTPUT_2 A_REGISTER_8BIT.INPUT_2 A_REGISTER_8BIT.OUTPUT_2 B_REGISTER_8BIT.INPUT_2 B_REGISTER_8BIT.OUTPUT_2 C_REGISTER_8BIT.OUTPUT_2 C_REGISTER_8BIT.INPUT_2 INSTRUCTION_REGISTER.OUTPUT_2 ARDUINO_INTERFACE.DATABUS_2
DATABUS_3: DATABUS.3 ; port SRAM_MEMORY.D3 INTERNAL_A_REGISTER_8BIT.INPUT_3 INTERNAL_A_REGISTER_8BIT.OUTPUT_3 FLAGS_OUTBUFFER.OUTPUT_3 FLAGS_INBUFFER.INPUT_3 OUTPUT_PORT_D.INPUT_3 OUTPUT_PORT_C.INPUT_3 INPUT_PORT_B.OUTPUT_3 INPUT_PORT_A.OUTPUT_3 INSTRUCTION_REGISTER.INPUT_3 A_REGISTER_8BIT.INPUT_3 A_REGISTER_8BIT.OUTPUT_3 B_REGISTER_8BIT.INPUT_3 B_REGISTER_8BIT.OUTPUT_3 C_REGISTER_8BIT.OUTPUT_3 C_REGISTER_8BIT.INPUT_3 INSTRUCTION_REGISTER.OUTPUT_3 ARDUINO_INTERFACE.DATABUS_3
DATABUS_4: DATABUS.4 ; port SRAM_MEMORY.D4 INTERNAL_A_REGISTER_8BIT.INPUT_4 INTERNAL_A_REGISTER_8BIT.OUTPUT_4 FLAGS_OUTBUFFER.OUTPUT_4 FLAGS_INBUFFER.INPUT_4 OUTPUT_PORT_D.INPUT_4 OUTPUT_PORT_C.INPUT_4 INPUT_PORT_B.OUTPUT_4 INPUT_PORT_A.OUTPUT_4 INSTRUCTION_REGISTER.INPUT_4 A_REGISTER_8BIT.INPUT_4 A_REGISTER_8BIT.OUTPUT_4 B_REGISTER_8BIT.INPUT_4 B_REGISTER_8BIT.OUTPUT_4 C_REGISTER_8BIT.OUTPUT_4 C_REGISTER_8BIT.INPUT_4 INSTRUCTION_REGISTER.OUTPUT_4 ARDUINO_INTERFACE.DATABUS_4
DATABUS_5: DATABUS.5 ; port SRAM_MEMORY.D5 INTERNAL_A_REGISTER_8BIT.INPUT_5 INTERNAL_A_REGISTER_8BIT.OUTPUT_5 FLAGS_OUTBUFFER.OUTPUT_5 FLAGS_INBUFFER.INPUT_5 OUTPUT_PORT_D.INPUT_5 OUTPUT_PORT_C.INPUT_5 INPUT_PORT_B.OUTPUT_5 INPUT_PORT_A.OUTPUT_5 INSTRUCTION_REGISTER.INPUT_5 A_REGISTER_8BIT.INPUT_5 A_REGISTER_8BIT.OUTPUT_5 B_REGISTER_8BIT.INPUT_5 B_REGISTER_8BIT.OUTPUT_5 C_REGISTER_8BIT.OUTPUT_5 C_REGISTER_8BIT.INPUT_5 INSTRUCTION_REGISTER.OUTPUT_5 ARDUINO_INTERFACE.DATABUS_5
DATABUS_6: DATABUS.6 ; port SRAM_MEMORY.D6 INTERNAL_A_REGISTER_8BIT.INPUT_6 INTERNAL_A_REGISTER_8BIT.OUTPUT_6 FLAGS_OUTBUFFER.OUTPUT_6 FLAGS_INBUFFER.INPUT_6 OUTPUT_PORT_D.INPUT_6 OUTPUT_PORT_C.INPUT_6 INPUT_PORT_B.OUTPUT_6 INPUT_PORT_A.OUTPUT_6 INSTRUCTION_REGISTER.INPUT_6 A_REGISTER_8BIT.INPUT_6 A_REGISTER_8BIT.OUTPUT_6 B_REGISTER_8BIT.INPUT_6 B_REGISTER_8BIT.OUTPUT_6 C_REGISTER_8BIT.OUTPUT_6 C_REGISTER_8BIT.INPUT_6 INSTRUCTION_REGISTER.OUTPUT_6 ARDUINO_INTERFACE.DATABUS_6
DATABUS_7: DATABUS.7 ; port SRAM_MEMORY.D7 INTERNAL_A_REGISTER_8BIT.INPUT_7 INTERNAL_A_REGISTER_8BIT.OUTPUT_7 FLAGS_OUTBUFFER.OUTPUT_7 FLAGS_INBUFFER.INPUT_7 OUTPUT_PORT_D.INPUT_7 OUTPUT_PORT_C.INPUT_7 INPUT_PORT_B.OUTPUT_7 INPUT_PORT_A.OUTPUT_7 INSTRUCTION_REGISTER.INPUT_7 A_REGISTER_8BIT.INPUT_7 A_REGISTER_8BIT.OUTPUT_7 B_REGISTER_8BIT.INPUT_7 B_REGISTER_8BIT.OUTPUT_7 C_REGISTER_8BIT.OUTPUT_7 C_REGISTER_8BIT.INPUT_7 INSTRUCTION_REGISTER.OUTPUT_7 ARDUINO_INTERFACE.DATABUS_7
DATABUS_8: DATABUS.8 ; port INTERNAL_A_REGISTER_8BIT.INPUT_8 INTERNAL_A_REGISTER_8BIT.OUTPUT_8 FLAGS_OUTBUFFER.OUTPUT_8 FLAGS_INBUFFER.INPUT_8 OUTPUT_PORT_D.INPUT_8 OUTPUT_PORT_C.INPUT_8 INPUT_PORT_B.OUTPUT_8 INPUT_PORT_A.OUTPUT_8 INSTRUCTION_REGISTER.INPUT_8 A_REGISTER_8BIT.INPUT_8 A_REGISTER_8BIT.OUTPUT_8 B_REGISTER_8BIT.OUTPUT_8 C_REGISTER_8BIT.OUTPUT_8 C_REGISTER_8BIT.INPUT_8 B_REGISTER_8BIT.INPUT_8 INSTRUCTION_REGISTER.OUTPUT_8 SRAM_MEMORY.D8 ARDUINO_INTERFACE.DATABUS_8
FLAGSBUS_1: FLAGSBUS.1 ; port FLAGS.INPUT_1 FLAGS.OUTPUT_1 FLAGS_SAVED.INPUT_1 FLAGS_SAVED.OUTPUT_1 FLAGS_OUTBUFFER.INPUT_1 FLAGS_INBUFFER.OUTPUT_1
FLAGSBUS_2: FLAGSBUS.2 ; port FLAGS.INPUT_2 FLAGS.OUTPUT_2 FLAGS_SAVED.INPUT_2 FLAGS_SAVED.OUTPUT_2 FLAGS_OUTBUFFER.INPUT_2 FLAGS_INBUFFER.OUTPUT_2
FLAGSBUS_3: FLAGSBUS.3 ; port FLAGS.INPUT_3 FLAGS.OUTPUT_3 FLAGS_SAVED.INPUT_3 FLAGS_SAVED.OUTPUT_3 FLAGS_OUTBUFFER.INPUT_3 FLAGS_INBUFFER.OUTPUT_3
FLAGSBUS_4: FLAGSBUS.4 ; port FLAGS.INPUT_4 FLAGS.OUTPUT_4 FLAGS_SAVED.INPUT_4 FLAGS_SAVED.OUTPUT_4 FLAGS_OUTBUFFER.INPUT_4 FLAGS_INBUFFER.OUTPUT_4
FLAGSBUS_5: FLAGSBUS.5 ; port FLAGS.INPUT_5 FLAGS.OUTPUT_5 FLAGS_SAVED.INPUT_5 FLAGS_SAVED.OUTPUT_5 FLAGS_OUTBUFFER.INPUT_5 FLAGS_INBUFFER.OUTPUT_5
FLAGSBUS_6: FLAGSBUS.6 ; port FLAGS.INPUT_6 FLAGS.OUTPUT_6 FLAGS_SAVED.INPUT_6 FLAGS_SAVED.OUTPUT_6 FLAGS_OUTBUFFER.INPUT_6 FLAGS_INBUFFER.OUTPUT_6
FLAGSBUS_7: FLAGSBUS.7 ; port FLAGS.INPUT_7 FLAGS.OUTPUT_7 FLAGS_SAVED.INPUT_7 FLAGS_SAVED.OUTPUT_7 FLAGS_OUTBUFFER.INPUT_7 FLAGS_INBUFFER.OUTPUT_7
FLAGSBUS_8: FLAGSBUS.8 ; port FLAGS.INPUT_8 FLAGS.OUTPUT_8 FLAGS_SAVED.INPUT_8 FLAGS_SAVED.OUTPUT_8 FLAGS_OUTBUFFER.INPUT_8 FLAGS_INBUFFER.OUTPUT_8
GND: POWER.2 ; port FLAGS_SAVED.GND B_REGISTER_8BIT.GND INC.GND SRAM_MEMORY.GND A_REGISTER_8BIT.GND FLAGS.GND FLAGS_OUTBUFFER.GND PC_INCREMENTER.GND PC.GND C_REGISTER_8BIT.GND INTERNAL_A_REGISTER_8BIT.GND OUTPUT_PORT_D.GND INSTRUCTION_REGISTER.GND OUTPUT_PORT_C.GND INPUT_PORT_A.GND INPUT_PORT_B.GND FLAGS_INBUFFER.GND CLOCK.GND T-STATE_DECODER.GND ARDUINO_INTERFACE.GND ADDER_16BIT.GND STOP_CPU_ENABLE.GND
INPUT_PORT_A_1: INPUT_PORTA.1 ; port INPUT_PORT_A.INPUT_1
INPUT_PORT_A_2: INPUT_PORTA.2 ; port INPUT_PORT_A.INPUT_2
INPUT_PORT_A_3: INPUT_PORTA.3 ; port INPUT_PORT_A.INPUT_3
INPUT_PORT_A_4: INPUT_PORTA.4 ; port INPUT_PORT_A.INPUT_4
INPUT_PORT_A_5: INPUT_PORTA.5 ; port INPUT_PORT_A.INPUT_5
INPUT_PORT_A_6: INPUT_PORTA.6 ; port INPUT_PORT_A.INPUT_6
INPUT_PORT_A_7: INPUT_PORTA.7 ; port INPUT_PORT_A.INPUT_7
INPUT_PORT_A_8: INPUT_PORTA.8 ; port INPUT_PORT_A.INPUT_8
INPUT_PORT_B_1: INPUT_PORTB.1 ; port INPUT_PORT_B.INPUT_1
INPUT_PORT_B_2: INPUT_PORTB.2 ; port INPUT_PORT_B.INPUT_2
INPUT_PORT_B_3: INPUT_PORTB.3 ; port INPUT_PORT_B.INPUT_3
INPUT_PORT_B_4: INPUT_PORTB.4 ; port INPUT_PORT_B.INPUT_4
INPUT_PORT_B_5: INPUT_PORTB.5 ; port INPUT_PORT_B.INPUT_5
INPUT_PORT_B_6: INPUT_PORTB.6 ; port INPUT_PORT_B.INPUT_6
INPUT_PORT_B_7: INPUT_PORTB.7 ; port INPUT_PORT_B.INPUT_7
INPUT_PORT_B_8: INPUT_PORTB.8 ; port INPUT_PORT_B.INPUT_8
LOAD_A: CONTROL_LINES.9 ; port A_REGISTER_8BIT.WRITE
LOAD_ADDER16BIT_INPUT_A: CONTROL_LINES.38 ; port ADDER_16BIT.LOAD_ADDER16BIT_INPUT_A
LOAD_ADDER16BIT_INPUT_B: CONTROL_LINES.40 ; port ADDER_16BIT.LOAD_ADDER16BIT_INPUT_B
LOAD_ADDER16BIT_OUTPUT_C: JP1.2 ; port ADDER_16BIT.LOAD_ADDER16BIT_OUTPUT_C
LOAD_B: CONTROL_LINES.11 ; port B_REGISTER_8BIT.WRITE
LOAD_C: CONTROL_LINES.13 ; port C_REGISTER_8BIT.WRITE
LOAD_FLAGS: CONTROL_LINES.28 ; port FLAGS.WRITE
LOAD_FLAGS_INBUFFER: CONTROL_LINES.34 ; port FLAGS_INBUFFER.WRITE
LOAD_FLAGS_OUTBUFFER: CONTROL_LINES.32 ; port FLAGS_OUTBUFFER.WRITE
LOAD_FLAGS_SAVED: CONTROL_LINES.30 ; port FLAGS_SAVED.WRITE
LOAD_INC: CONTROL_LINES.1 ; port INC.WRITE
LOAD_INSTRUCTION_REGISTER: CONTROL_LINES.22 ; port INSTRUCTION_REGISTER.WRITE
LOAD_INTERNAL_A: CONTROL_LINES.15 ; port INTERNAL_A_REGISTER_8BIT.WRITE
LOAD_PC: CONTROL_LINES.3 ; port PC.WRITE
LOAD_PORT_A: CONTROL_LINES.24 ; port INPUT_PORT_A.WRITE
LOAD_PORT_B: CONTROL_LINES.26 ; port INPUT_PORT_B.WRITE
LOAD_PORT_C: CONTROL_LINES.17
LOAD_PORT_D: CONTROL_LINES.19 ; port OUTPUT_PORT_D.WRITE
MANUAL_TICK: CONTROL_LINES.36 ; port CLOCK.MANUAL_TICK
N$1: port ARDUINO_INTERFACE.LOAD_SRAM_OUTPUT SRAM_MEMORY.WRITE
N$2: port ARDUINO_INTERFACE.SELECT_SRAM_OUTPUT SRAM_MEMORY.READ
N$3: port T-STATE_DECODER.OUTPUT8 STOP_CPU_ENABLE.INPUT_8
N$4: port T-STATE_DECODER.OUTPUT7 STOP_CPU_ENABLE.INPUT_7
N$5: port T-STATE_DECODER.OUTPUT6 STOP_CPU_ENABLE.INPUT_6
N$6: port T-STATE_DECODER.OUTPUT5 STOP_CPU_ENABLE.INPUT_5
N$7: port T-STATE_DECODER.OUTPUT4 STOP_CPU_ENABLE.INPUT_4
N$8: port T-STATE_DECODER.OUTPUT3 STOP_CPU_ENABLE.INPUT_3
N$9: port T-STATE_DECODER.OUTPUT2 STOP_CPU_ENABLE.INPUT_2
N$10: port T-STATE_DECODER.OUTPUT1 STOP_CPU_ENABLE.INPUT_1
N$11: T-STATES.1 ; port STOP_CPU_ENABLE.OUTPUT_1
N$12: T-STATES.2 ; port STOP_CPU_ENABLE.OUTPUT_2
N$13: T-STATES.3 ; port STOP_CPU_ENABLE.OUTPUT_3
N$14: T-STATES.4 ; port STOP_CPU_ENABLE.OUTPUT_4
N$15: T-STATES.5 ; port STOP_CPU_ENABLE.OUTPUT_5
N$16: T-STATES.6 ; port STOP_CPU_ENABLE.OUTPUT_6
N$17: T-STATES.7 ; port STOP_CPU_ENABLE.OUTPUT_7
N$18: T-STATES.8 ; port STOP_CPU_ENABLE.OUTPUT_8
N$28: port CLOCK.S1 T-STATE_DECODER.INPUT1
N$30: port PC_INCREMENTER.OUTPUT_16 INC.INPUT_16
N$31: port PC_INCREMENTER.OUTPUT_15 INC.INPUT_15
N$32: port PC_INCREMENTER.OUTPUT_14 INC.INPUT_14
N$33: port INC.INPUT_13 PC_INCREMENTER.OUTPUT_13
N$34: port PC_INCREMENTER.OUTPUT_12 INC.INPUT_12
N$35: port INC.INPUT_11 PC_INCREMENTER.OUTPUT_11
N$36: port PC_INCREMENTER.OUTPUT_10 INC.INPUT_10
N$37: port INC.INPUT_9 PC_INCREMENTER.OUTPUT_9
N$38: port PC_INCREMENTER.OUTPUT_8 INC.INPUT_8
N$39: port INC.INPUT_7 PC_INCREMENTER.OUTPUT_7
N$40: port PC_INCREMENTER.OUTPUT_6 INC.INPUT_6
N$41: port INC.INPUT_5 PC_INCREMENTER.OUTPUT_5
N$42: port PC_INCREMENTER.OUTPUT_4 INC.INPUT_4
N$43: port INC.INPUT_3 PC_INCREMENTER.OUTPUT_3
N$44: port PC_INCREMENTER.OUTPUT_2 INC.INPUT_2
N$45: port INC.INPUT_1 PC_INCREMENTER.OUTPUT_1
N$101: port CLOCK.S2 T-STATE_DECODER.INPUT2
N$135: port CLOCK.S3 T-STATE_DECODER.INPUT3
OUTPUT_PORT_C_1: OUTPUT_PORTC.1 ; port OUTPUT_PORT_C.OUTPUT_1
OUTPUT_PORT_C_2: OUTPUT_PORTC.2 ; port OUTPUT_PORT_C.OUTPUT_2
OUTPUT_PORT_C_3: OUTPUT_PORTC.3 ; port OUTPUT_PORT_C.OUTPUT_3
OUTPUT_PORT_C_4: OUTPUT_PORTC.4 ; port OUTPUT_PORT_C.OUTPUT_4
OUTPUT_PORT_C_5: OUTPUT_PORTC.5 ; port OUTPUT_PORT_C.OUTPUT_5
OUTPUT_PORT_C_6: OUTPUT_PORTC.6 ; port OUTPUT_PORT_C.OUTPUT_6
OUTPUT_PORT_C_7: OUTPUT_PORTC.7 ; port OUTPUT_PORT_C.OUTPUT_7
OUTPUT_PORT_C_8: OUTPUT_PORTC.8 ; port OUTPUT_PORT_C.OUTPUT_8
OUTPUT_PORT_D_1: OUTPUT_PORTD.1 ; port OUTPUT_PORT_D.OUTPUT_1
OUTPUT_PORT_D_2: OUTPUT_PORTD.2 ; port OUTPUT_PORT_D.OUTPUT_2
OUTPUT_PORT_D_3: OUTPUT_PORTD.3 ; port OUTPUT_PORT_D.OUTPUT_3
OUTPUT_PORT_D_4: OUTPUT_PORTD.4 ; port OUTPUT_PORT_D.OUTPUT_4
OUTPUT_PORT_D_5: OUTPUT_PORTD.5 ; port OUTPUT_PORT_D.OUTPUT_5
OUTPUT_PORT_D_6: OUTPUT_PORTD.6 ; port OUTPUT_PORT_D.OUTPUT_6
OUTPUT_PORT_D_7: OUTPUT_PORTD.7 ; port OUTPUT_PORT_D.OUTPUT_7
OUTPUT_PORT_D_8: OUTPUT_PORTD.8 ; port OUTPUT_PORT_D.OUTPUT_8
PC_INCREMENTER_ENABLE: CONTROL_LINES.5 ; port PC_INCREMENTER.ENABLE
SELECT_A: CONTROL_LINES.8 ; port A_REGISTER_8BIT.READ
SELECT_ADDER16BIT_INPUT_A: CONTROL_LINES.39 ; port ADDER_16BIT.SELECT_ADDER16BIT_INPUT_A
SELECT_ADDER16BIT_INPUT_B: JP1.1 ; port ADDER_16BIT.SELECT_ADDER16BIT_INPUT_B
SELECT_ADDER16BIT_OUTPUT_C: JP1.3 ; port ADDER_16BIT.SELECT_ADDER16BIT_OUTPUT_C
SELECT_B: CONTROL_LINES.10 ; port B_REGISTER_8BIT.READ
SELECT_C: CONTROL_LINES.12 ; port C_REGISTER_8BIT.READ
SELECT_FLAGS: CONTROL_LINES.27 ; port FLAGS.READ
SELECT_FLAGS_INBUFFER: CONTROL_LINES.33 ; port FLAGS_INBUFFER.READ
SELECT_FLAGS_OUTBUFFER: CONTROL_LINES.31 ; port FLAGS_OUTBUFFER.READ
SELECT_FLAGS_SAVED: CONTROL_LINES.29
SELECT_INC: CONTROL_LINES.2 ; port INC.READ
SELECT_INSTRUCTION_REGISTER_TO_ALU: CONTROL_LINES.20 ; port INSTRUCTION_REGISTER.SELECT_TO_ALU
SELECT_INSTRUCTION_REGISTER_TO_DATABUS: CONTROL_LINES.21 ; port INSTRUCTION_REGISTER.SELECT_TO_DATABUS
SELECT_INTERNAL_A: CONTROL_LINES.14 ; port INTERNAL_A_REGISTER_8BIT.READ
SELECT_PC: CONTROL_LINES.4 ; port PC.READ
SELECT_PORT_A: CONTROL_LINES.23 ; port INPUT_PORT_A.READ
SELECT_PORT_B: CONTROL_LINES.25 ; port INPUT_PORT_B.READ
SELECT_PORT_C: CONTROL_LINES.16 ; port OUTPUT_PORT_C.READ
SELECT_PORT_D: CONTROL_LINES.18 ; port OUTPUT_PORT_D.READ
SRAM_LOAD: CONTROL_LINES.6 ; port ARDUINO_INTERFACE.LOAD_SRAM_INPUT
SRAM_SELECT: CONTROL_LINES.7 ; port ARDUINO_INTERFACE.SELECT_SRAM_INPUT
VCC: POWER.1 ; port T-STATE_DECODER.VCC OUTPUT_PORT_D.VCC OUTPUT_PORT_C.VCC INPUT_PORT_A.VCC INPUT_PORT_B.VCC INSTRUCTION_REGISTER.VCC B_REGISTER_8BIT.VCC INC.VCC SRAM_MEMORY.VCC A_REGISTER_8BIT.VCC FLAGS.VCC FLAGS_OUTBUFFER.VCC PC_INCREMENTER.VCC PC.VCC C_REGISTER_8BIT.VCC INTERNAL_A_REGISTER_8BIT.VCC FLAGS_SAVED.VCC FLAGS_INBUFFER.VCC CLOCK.VCC ARDUINO_INTERFACE.VCC ADDER_16BIT.VCC STOP_CPU_ENABLE.VCC

### Library data of the parts
ADDRESSBUS = pinhead:PINHD-1X16: PIN HEADER
ALU_FUNCTION_CODE JP1 = pinhead:PINHD-1X4: PIN HEADER
CONTROL_LINES = pinhead:PINHD-1X40: PIN HEADER
CURRENT_INSTRUCTION DATABUS FLAGSBUS INPUT_PORTA INPUT_PORTB OUTPUT_PORTC OUTPUT_PORTD T-STATES = pinhead:PINHD-1X8: PIN HEADER
POWER = pinhead:PINHD-1X2: PIN HEADER